# Altium project MOTHERBOARD.PrjPcb
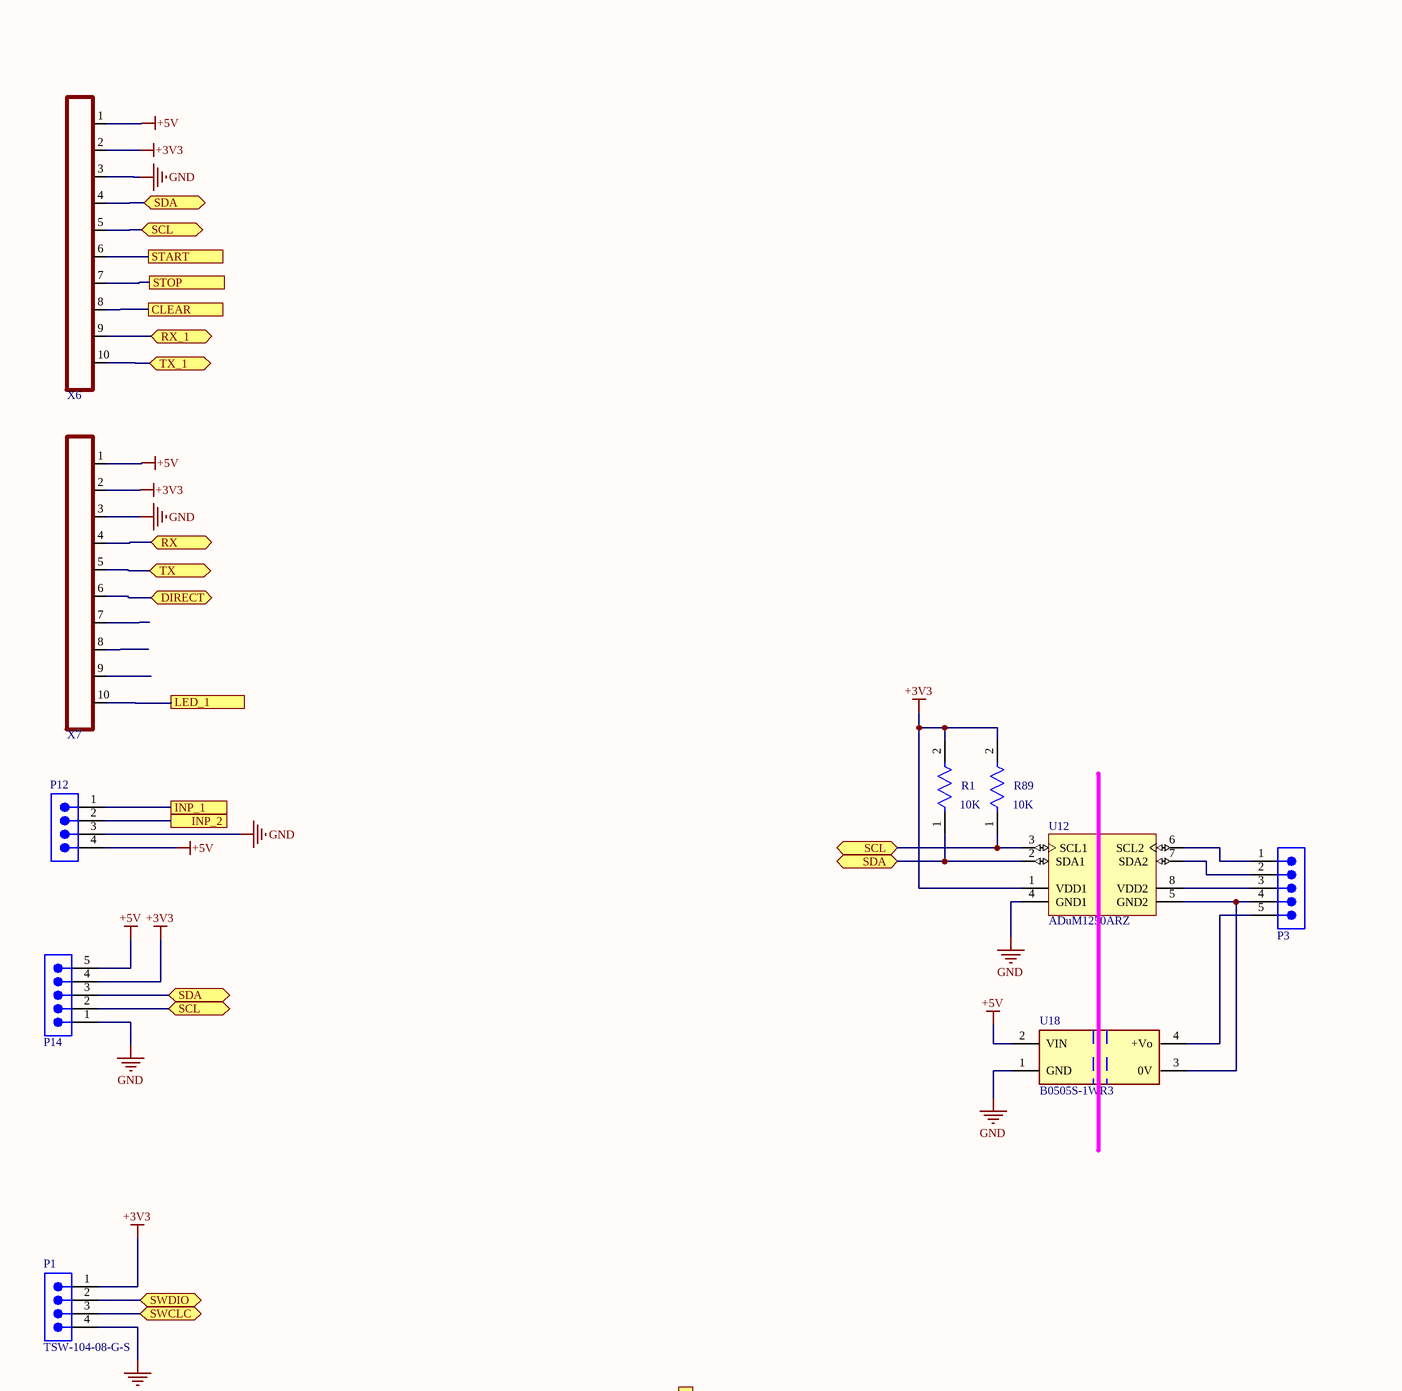
[diagram p0: MOTHERBOARD.SchDoc, top column 1 of 4]
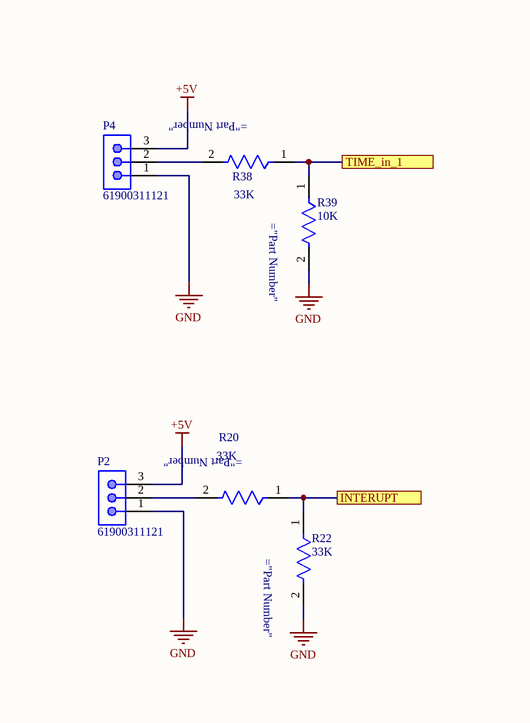
[diagram p1: MOTHERBOARD.SchDoc, top column 2 of 4]
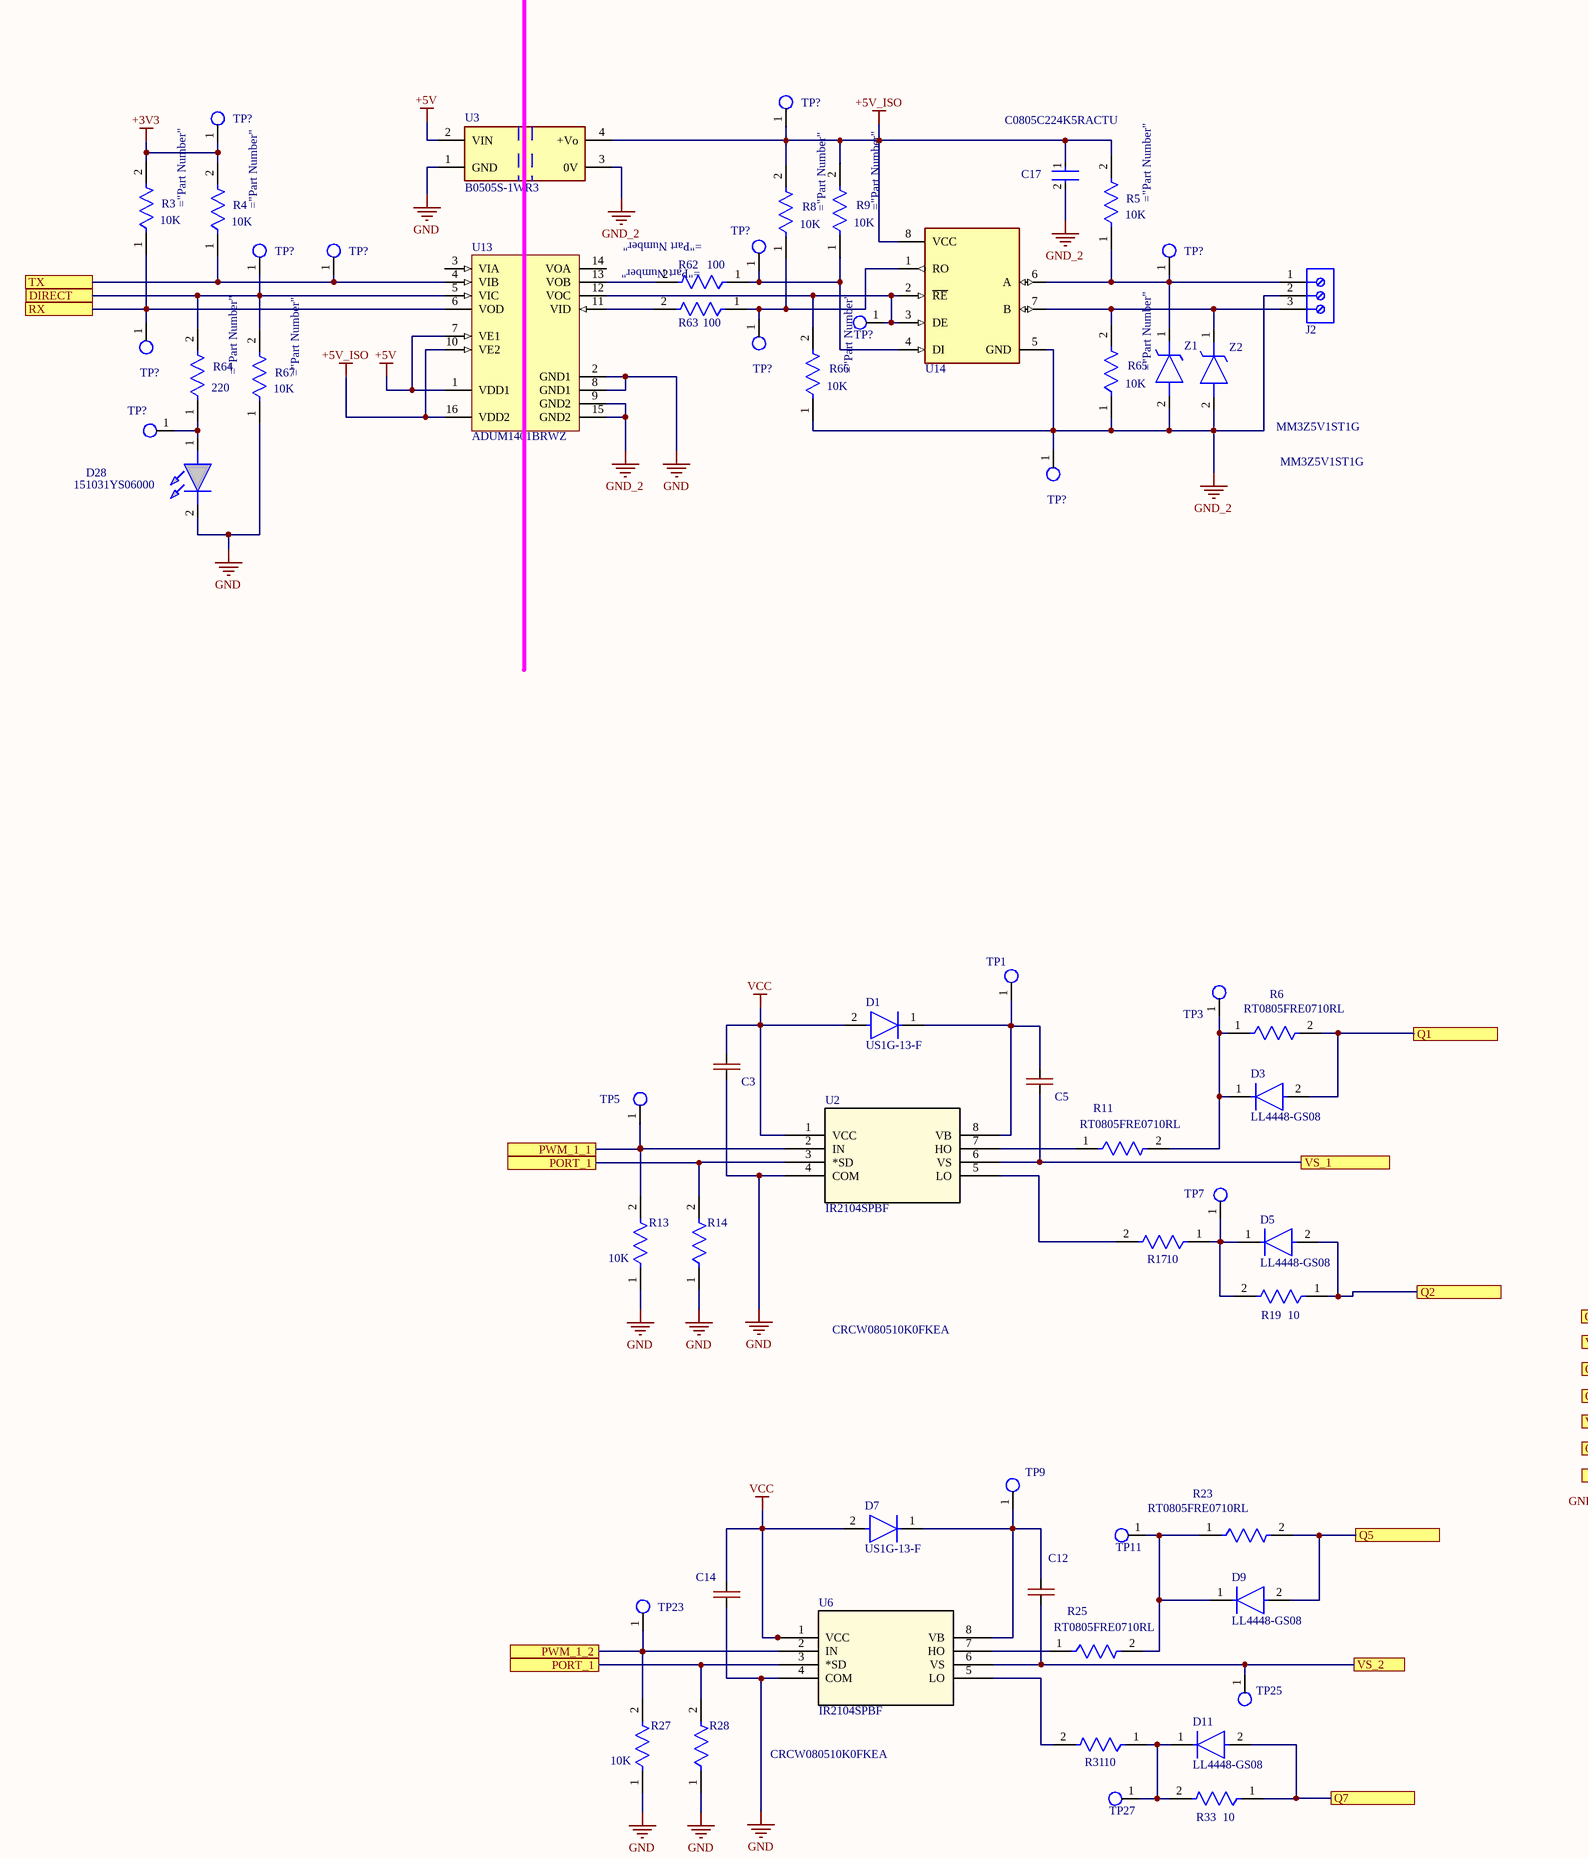
[diagram p2: MOTHERBOARD.SchDoc, top column 3 of 4]
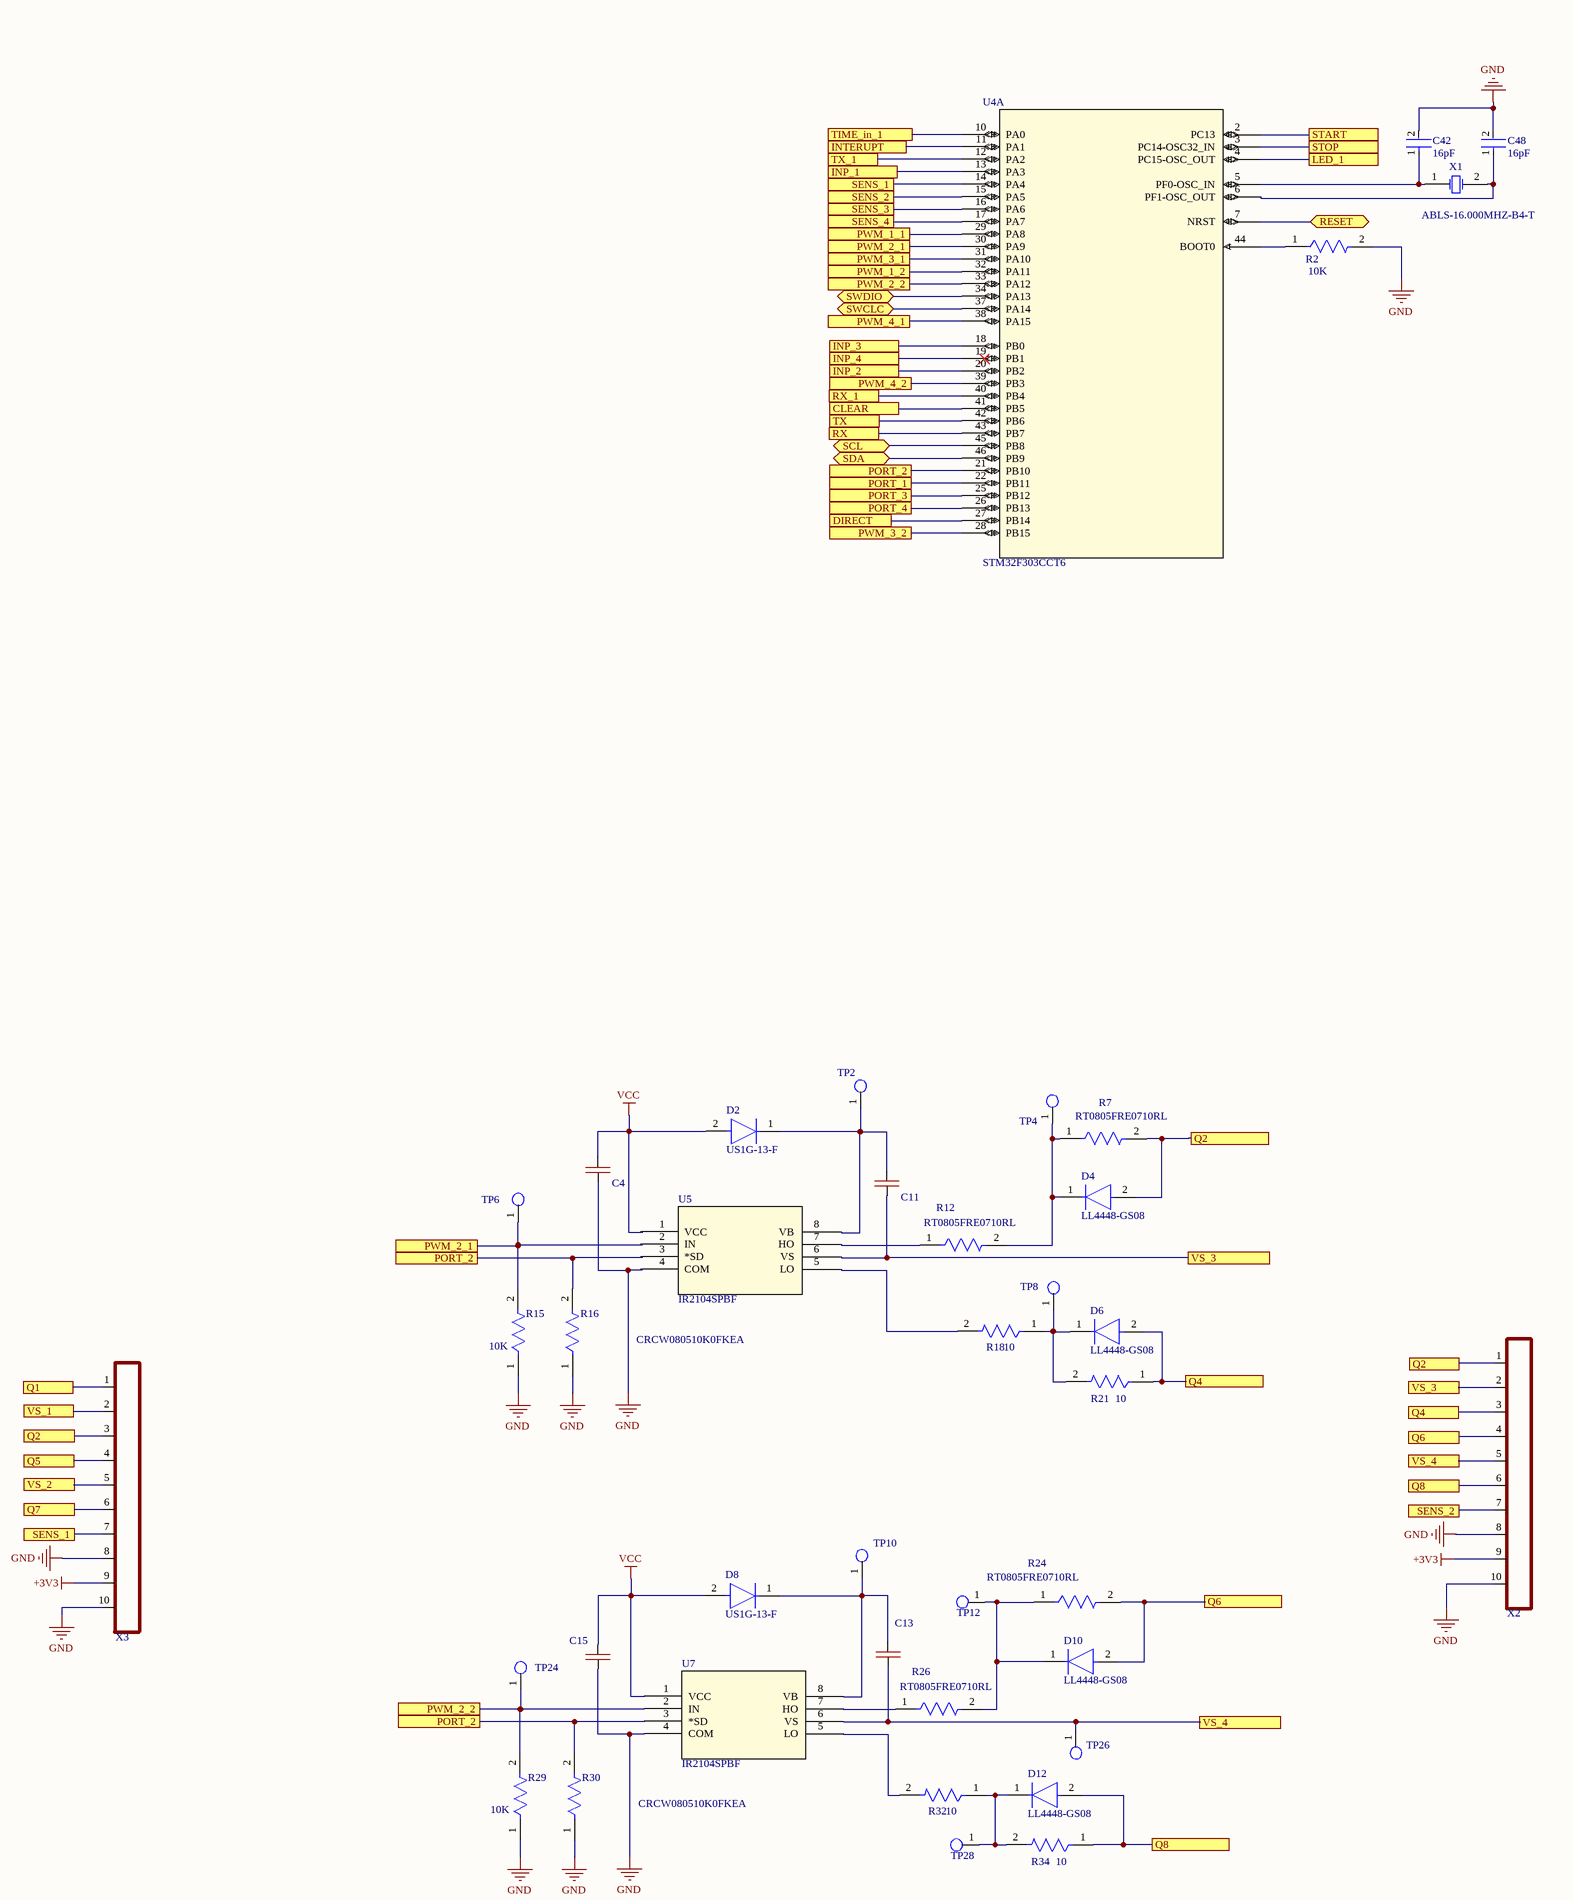
[diagram p3: MOTHERBOARD.SchDoc, top column 4 of 4]
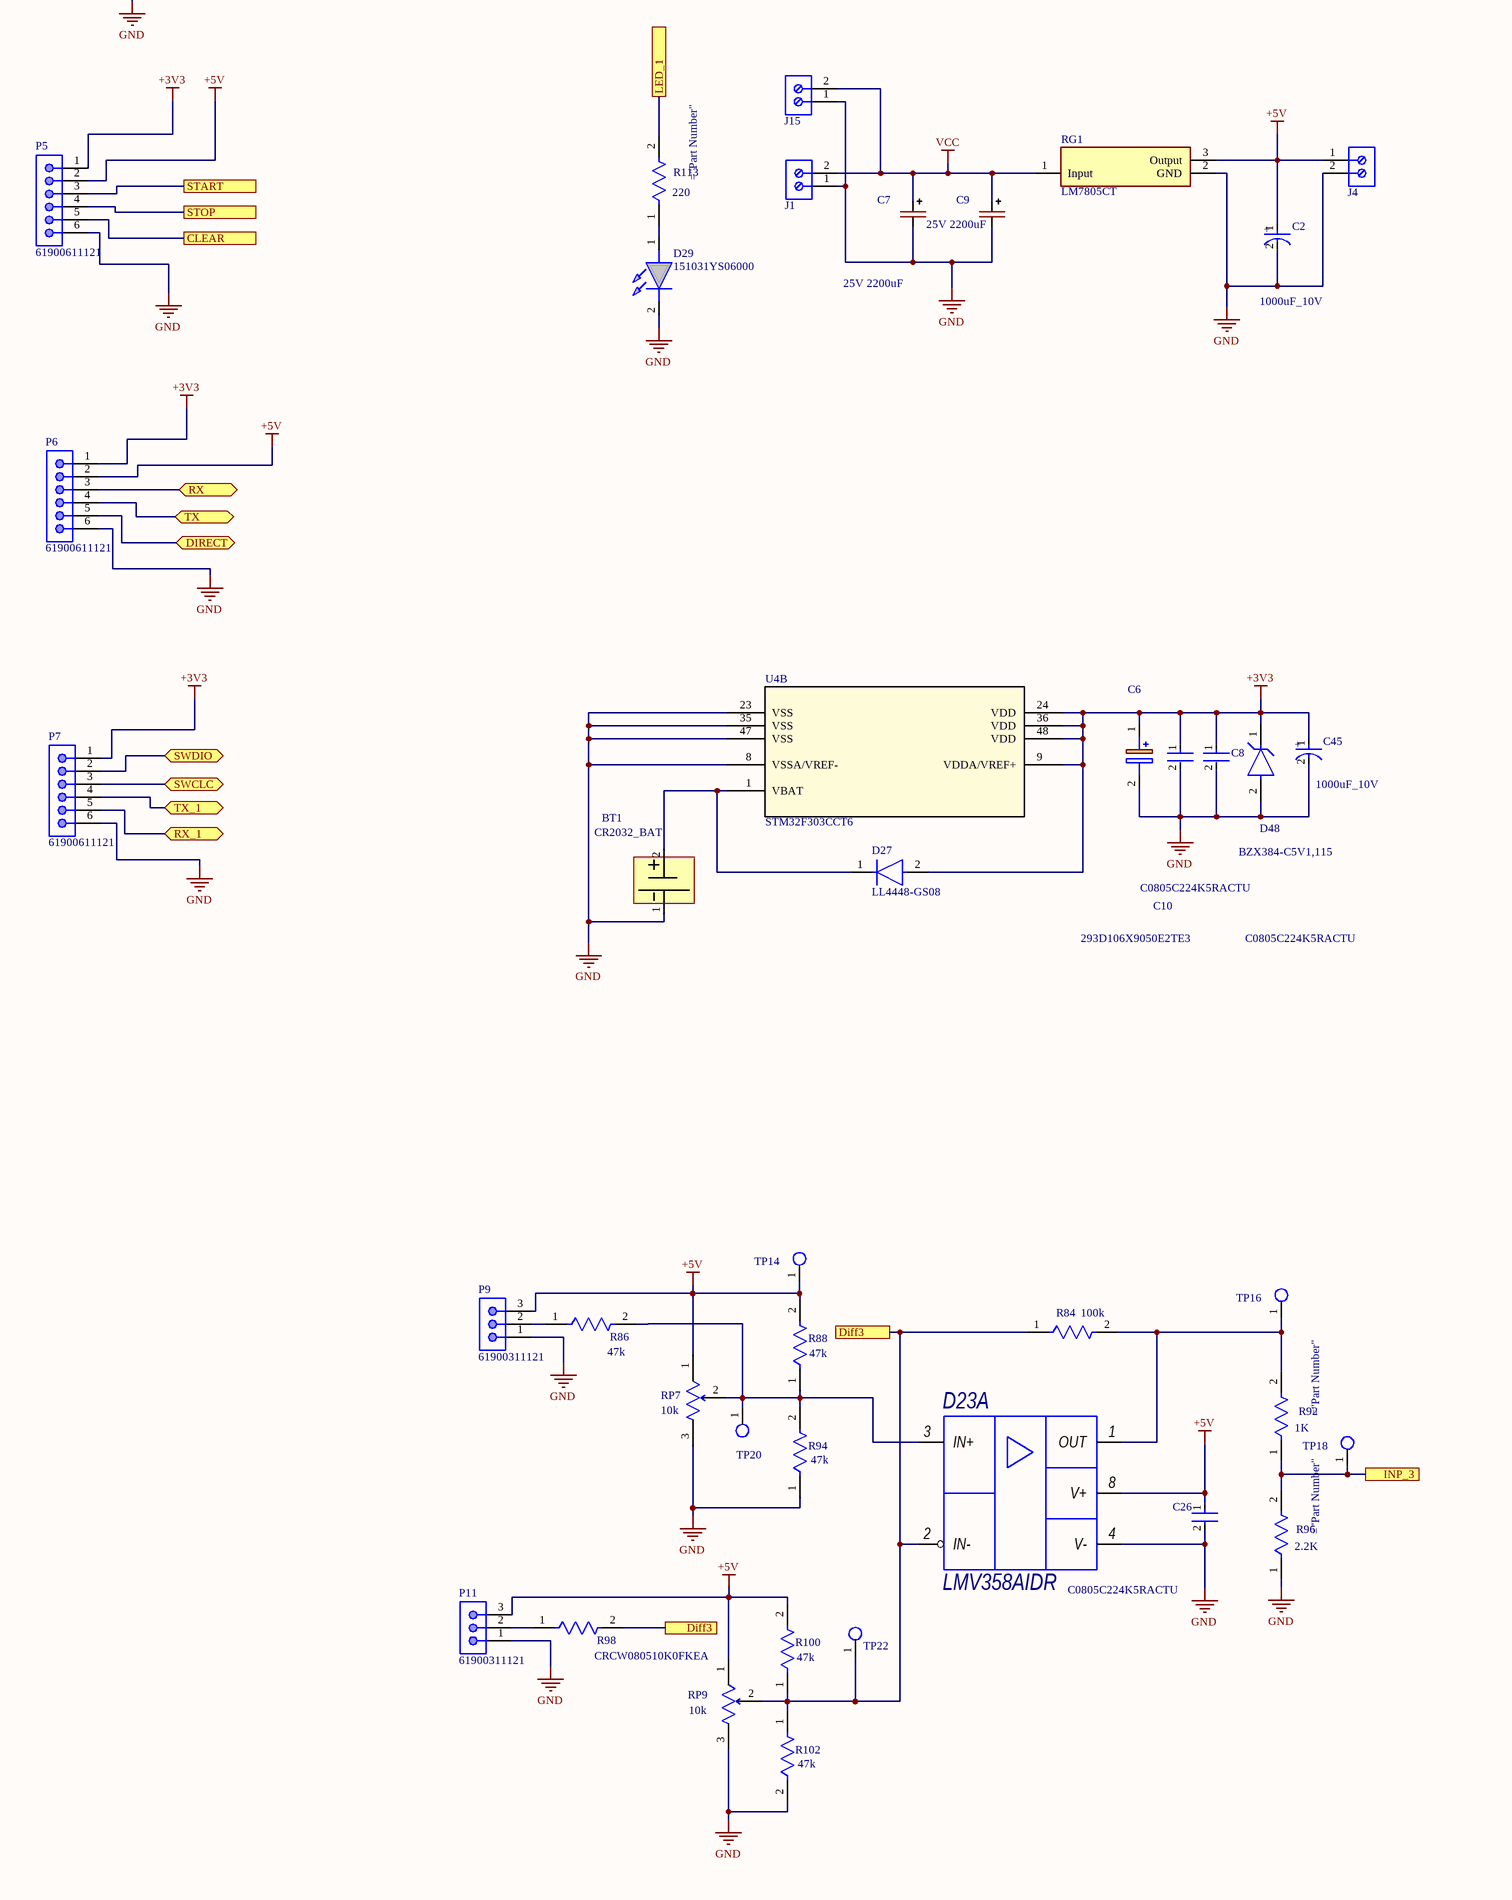
[diagram p4: MOTHERBOARD.SchDoc, bottom column 1 of 4]
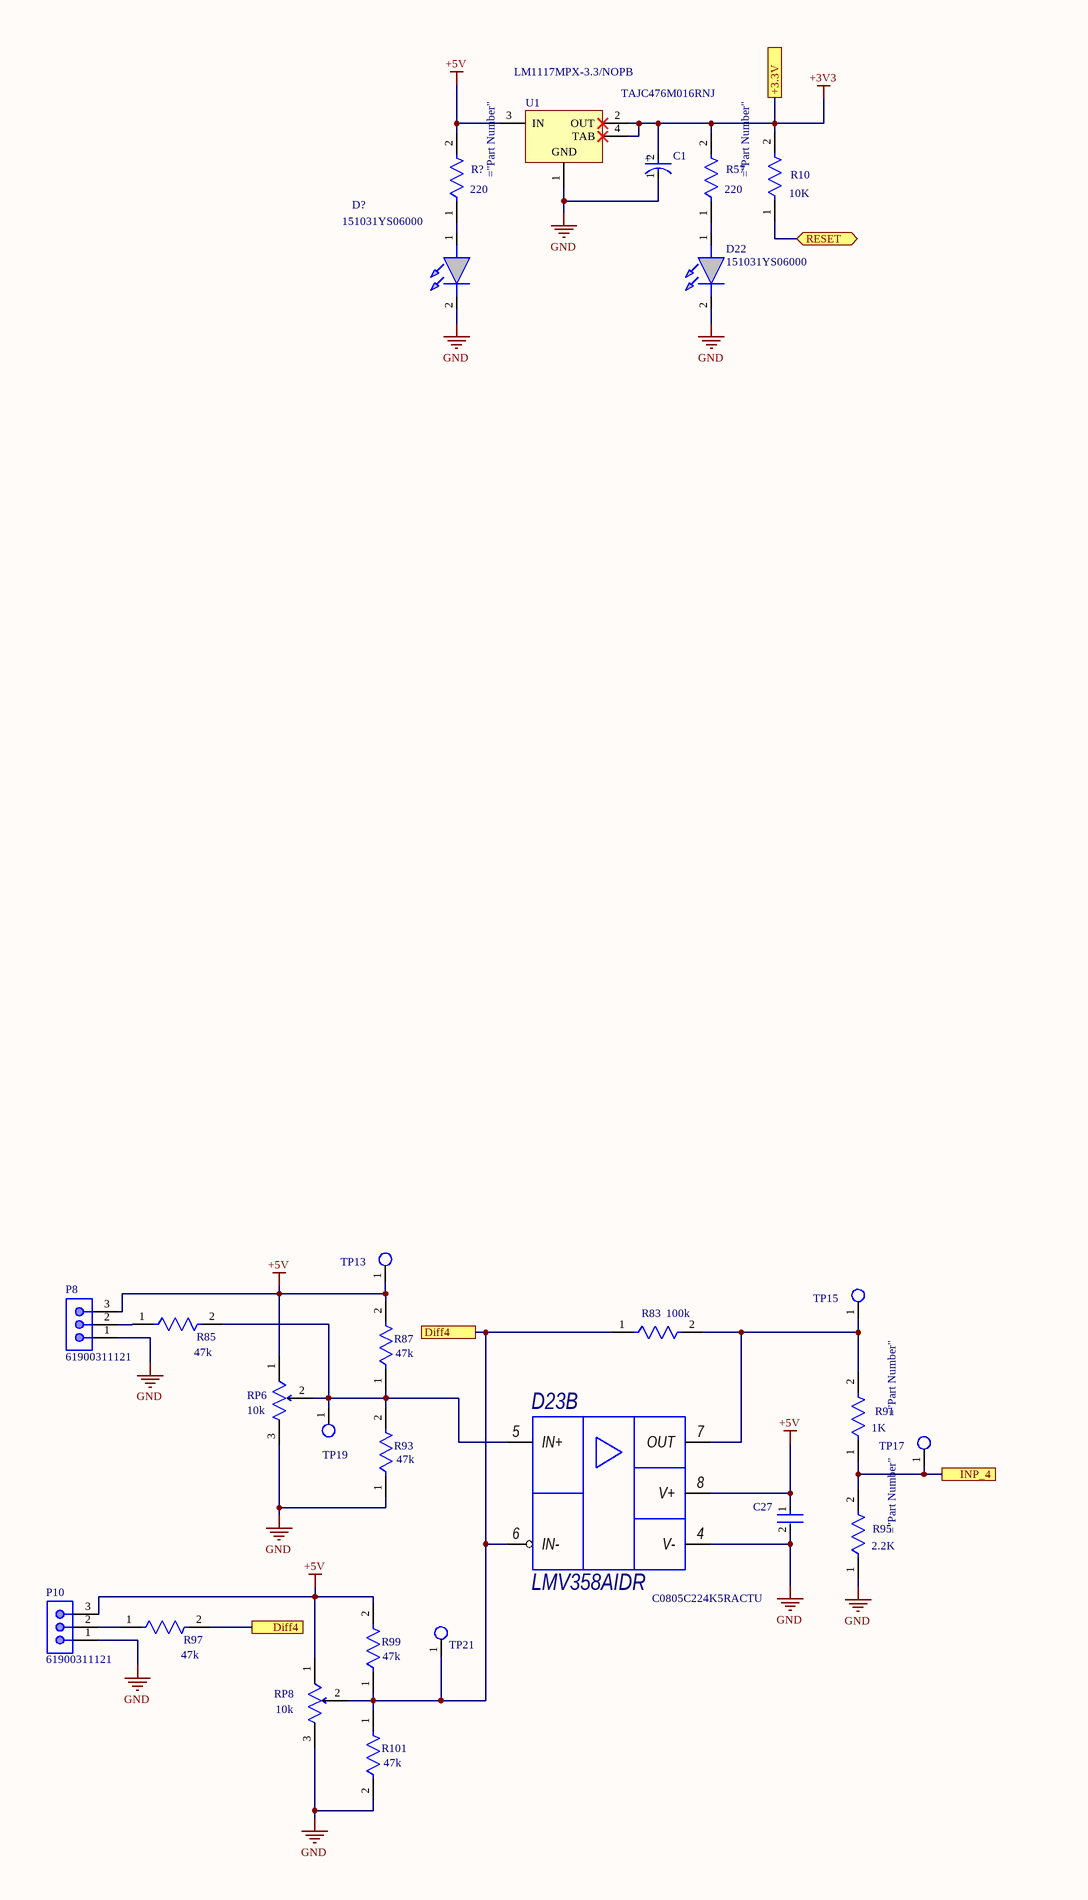
[diagram p5: MOTHERBOARD.SchDoc, bottom column 2 of 4]
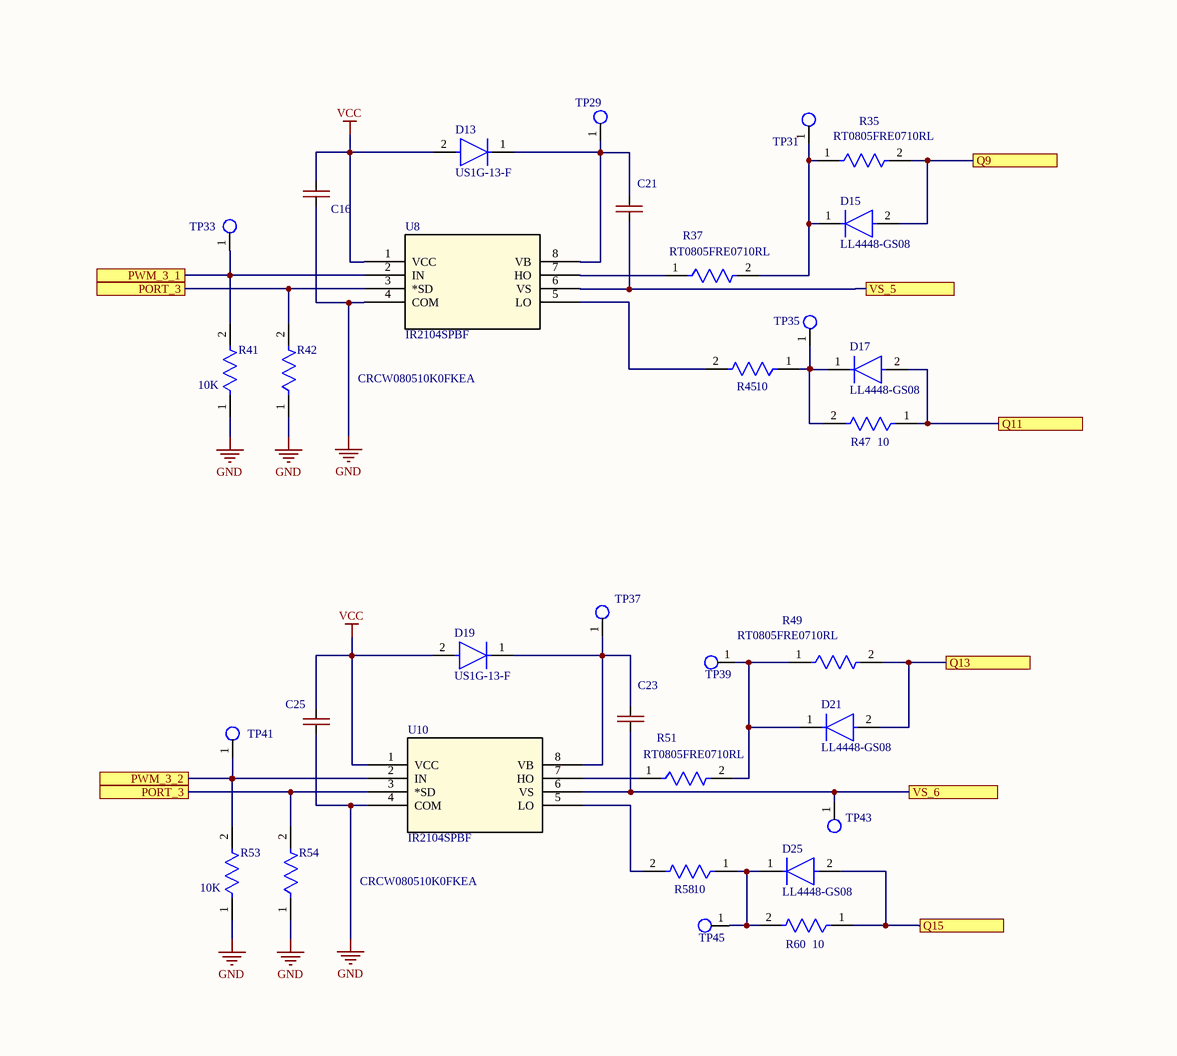
[diagram p6: MOTHERBOARD.SchDoc, bottom column 3 of 4]
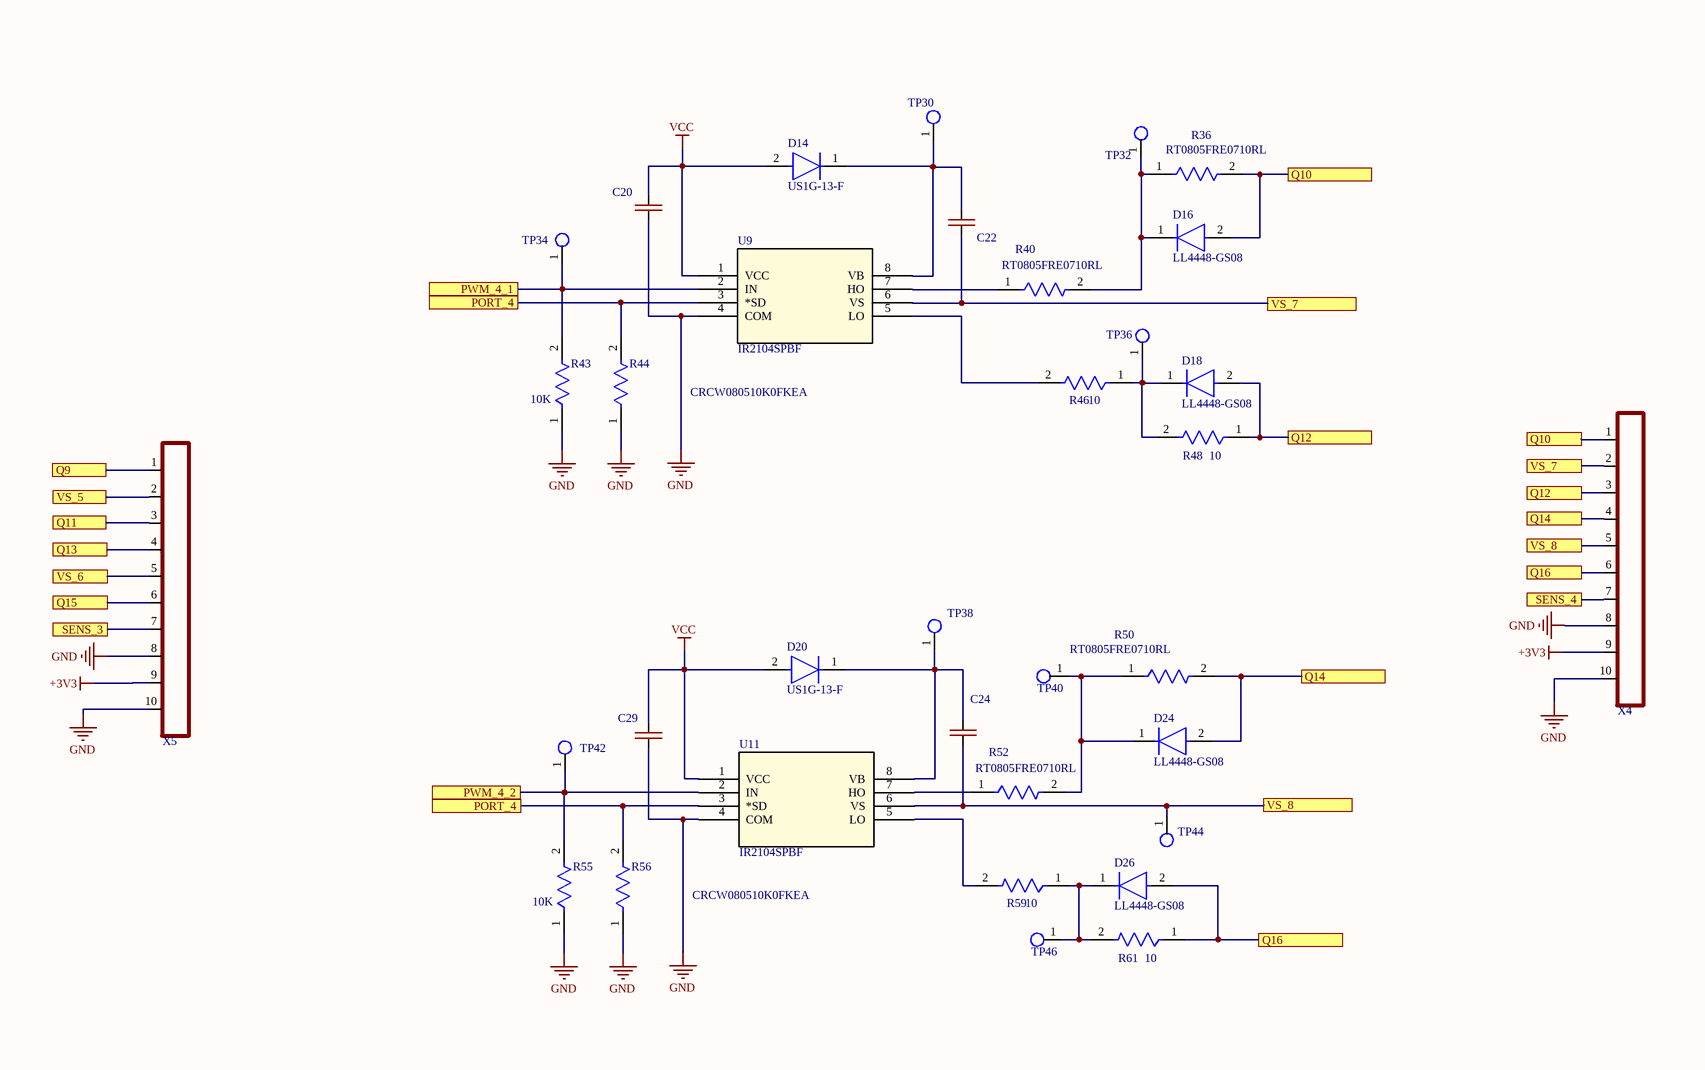
[diagram p7: MOTHERBOARD.SchDoc, bottom column 4 of 4]
1 sheet, 252 parts. Net scope: flat (ports and power ports of the same name join across sheets).
Board file: MOTHERBOARD.PcbDoc

## Sheet MOTHERBOARD.SchDoc
size 1249 x 800 mm; SheetNumber: 1; SheetTotal: 1

### Parts
(Parts that share a designator on the sheet are numbered #1, #2 ... from top to bottom, then left to right.)
BT1  CR2032_BAT  [CR2032_BAT]
C1  TAJC476M016RNJ  [FP-TAJC-MFG]
C2  1000uF_10V  [1000uF_10V_Size_F]
C3  CAP-NON-POLAR  [CAP-1206]  (value not drawn)
C4  CAP-NON-POLAR  [CAP-1206]  (value not drawn)
C5  CAP-NON-POLAR  [CAP-1206]  (value not drawn)
C6  293D106X9050E2TE3  [CAPPM7343X430N]
C7  25V 2200uF  [CAPPOL-12x25]
C8  C0805C224K5RACTU  [FP-C0805C-DN-MFG]
C9  25V 2200uF  [CAPPOL-12x25]
C10  C0805C224K5RACTU  [FP-C0805C-DN-MFG]
C11  CAP-NON-POLAR  [CAP-1206]  (value not drawn)
C12  CAP-NON-POLAR  [CAP-1206]  (value not drawn)
C13  CAP-NON-POLAR  [CAP-1206]  (value not drawn)
C14  CAP-NON-POLAR  [CAP-1206]  (value not drawn)
C15  CAP-NON-POLAR  [CAP-1206]  (value not drawn)
C16  CAP-NON-POLAR  [CAP-1206]  (value not drawn)
C17  C0805C224K5RACTU  [FP-C0805C-DN-MFG]
C20  CAP-NON-POLAR  [CAP-1206]  (value not drawn)
C21  CAP-NON-POLAR  [CAP-1206]  (value not drawn)
C22  CAP-NON-POLAR  [CAP-1206]  (value not drawn)
C23  CAP-NON-POLAR  [CAP-1206]  (value not drawn)
C24  CAP-NON-POLAR  [CAP-1206]  (value not drawn)
C25  CAP-NON-POLAR  [CAP-1206]  (value not drawn)
C26  C0805C224K5RACTU  [FP-C0805C-DN-MFG]
C27  C0805C224K5RACTU  [FP-C0805C-DN-MFG]
C29  CAP-NON-POLAR  [CAP-1206]  (value not drawn)
C42  16pF  [FP-C0805C-DN-MFG]
C45  1000uF_10V  [1000uF_10V_Size_F]
C48  16pF  [FP-C0805C-DN-MFG]
D1  US1G-13-F  [FP-SMA-MFG]
D2  US1G-13-F  [FP-SMA-MFG]
D3  LL4448-GS08  [FP-6_560-5005_01-4-MFG]
D4  LL4448-GS08  [FP-6_560-5005_01-4-MFG]
D5  LL4448-GS08  [FP-6_560-5005_01-4-MFG]
D6  LL4448-GS08  [FP-6_560-5005_01-4-MFG]
D7  US1G-13-F  [FP-SMA-MFG]
D8  US1G-13-F  [FP-SMA-MFG]
D9  LL4448-GS08  [FP-6_560-5005_01-4-MFG]
D10  LL4448-GS08  [FP-6_560-5005_01-4-MFG]
D11  LL4448-GS08  [FP-6_560-5005_01-4-MFG]
D12  LL4448-GS08  [FP-6_560-5005_01-4-MFG]
D13  US1G-13-F  [FP-SMA-MFG]
D14  US1G-13-F  [FP-SMA-MFG]
D15  LL4448-GS08  [FP-6_560-5005_01-4-MFG]
D16  LL4448-GS08  [FP-6_560-5005_01-4-MFG]
D17  LL4448-GS08  [FP-6_560-5005_01-4-MFG]
D18  LL4448-GS08  [FP-6_560-5005_01-4-MFG]
D19  US1G-13-F  [FP-SMA-MFG]
D20  US1G-13-F  [FP-SMA-MFG]
D21  LL4448-GS08  [FP-6_560-5005_01-4-MFG]
D22  151031YS06000  [LED_Yellow]
D23  LMV358AIDR  [8-SOIC]  (parts A,B of 2)
D24  LL4448-GS08  [FP-6_560-5005_01-4-MFG]
D25  LL4448-GS08  [FP-6_560-5005_01-4-MFG]
D26  LL4448-GS08  [FP-6_560-5005_01-4-MFG]
D27  LL4448-GS08  [FP-6_560-5005_01-4-MFG]
D28  151031YS06000  [LED_BLUE]
D29  151031YS06000  [Wurth_Electronics_0_MFG]
D48  BZX384-C5V1,115  [FP-SOD323-MFG]
D?  151031YS06000  [LED_Yellow]
J1  691101710002  [691101710002]  (value not drawn)
J2  691101710003  [691101710003]  (value not drawn)
J4  691101710002  [691101710002]  (value not drawn)
J15  691101710002  [691101710002]  (value not drawn)
P1  TSW-104-08-G-S  [SMTC-TSW-104-08-X-S]
P2  61900311121  [61900311121]
P3  61900511121  [61900511121]  (value not drawn)
P4  61900311121  [61900311121]
P5  61900611121  [61900611121]
P6  61900611121  [61900611121]
P7  61900611121  [61900611121]
P8  61900311121  [61900311121]
P9  61900311121  [61900311121]
P10  61900311121  [61900311121]
P11  61900311121  [61900311121]
P12  TSW-104-08-G-S  [SMTC-TSW-104-08-X-S]  (value not drawn)
P14  61300511121  [61300511121]  (value not drawn)
R1  10K  [Vishay_CRCW0805-e3_IPC_A]
R2  10K  [Vishay_CRCW0805-e3_IPC_A]
R3  10K  [Vishay_CRCW0805-e3_IPC_A]
R4  10K  [Vishay_CRCW0805-e3_IPC_A]
R5  10K  [Vishay_CRCW0805-e3_IPC_A]
R6  RT0805FRE0710RL  [FP-RT0805-IPC_C]
R7  RT0805FRE0710RL  [FP-RT0805-IPC_C]
R8  10K  [Yageo_RC0805_IPC_A]
R9  10K  [Yageo_RC0805_IPC_A]
R10  10K  [Vishay_CRCW0805-e3_IPC_A]
R11  RT0805FRE0710RL  [FP-RT0805-MFG]
R12  RT0805FRE0710RL  [FP-RT0805-MFG]
R13  10K  [FP-CRCW0805-e3-IPC_A]
R14  CRCW080510K0FKEA  [FP-CRCW0805-e3-IPC_A]
R15  10K  [FP-CRCW0805-e3-IPC_A]
R16  CRCW080510K0FKEA  [FP-CRCW0805-e3-IPC_A]
R17  10  [Vishay_CRCW0805-e3_IPC_A]
R18  10  [Vishay_CRCW0805-e3_IPC_A]
R19  10  [FP-CRCW0805-e3-IPC_B]
R20  33K  [Vishay_CRCW0805-e3_IPC_A]
R21  10  [FP-CRCW0805-e3-IPC_B]
R22  33K  [Vishay_CRCW0805-e3_IPC_A]
R23  RT0805FRE0710RL  [FP-RT0805-IPC_C]
R24  RT0805FRE0710RL  [FP-RT0805-IPC_C]
R25  RT0805FRE0710RL  [FP-RT0805-MFG]
R26  RT0805FRE0710RL  [FP-RT0805-MFG]
R27  10K  [FP-CRCW0805-e3-IPC_A]
R28  CRCW080510K0FKEA  [FP-CRCW0805-e3-IPC_A]
R29  10K  [FP-CRCW0805-e3-IPC_A]
R30  CRCW080510K0FKEA  [FP-CRCW0805-e3-IPC_A]
R31  10  [Vishay_CRCW0805-e3_IPC_A]
R32  10  [Vishay_CRCW0805-e3_IPC_A]
R33  10  [Vishay_CRCW0805-e3_IPC_A]
R34  10  [Vishay_CRCW0805-e3_IPC_A]
R35  RT0805FRE0710RL  [FP-RT0805-IPC_C]
R36  RT0805FRE0710RL  [FP-RT0805-IPC_C]
R37  RT0805FRE0710RL  [FP-RT0805-MFG]
R38  33K  [Vishay_CRCW0805-e3_IPC_A]
R39  10K  [Vishay_CRCW0805-e3_IPC_A]
R40  RT0805FRE0710RL  [FP-RT0805-MFG]
R41  10K  [FP-CRCW0805-e3-IPC_A]
R42  CRCW080510K0FKEA  [FP-CRCW0805-e3-IPC_A]
R43  10K  [FP-CRCW0805-e3-IPC_A]
R44  CRCW080510K0FKEA  [FP-CRCW0805-e3-IPC_A]
R45  10  [Vishay_CRCW0805-e3_IPC_A]
R46  10  [Vishay_CRCW0805-e3_IPC_A]
R47  10  [FP-CRCW0805-e3-IPC_B]
R48  10  [FP-CRCW0805-e3-IPC_B]
R49  RT0805FRE0710RL  [FP-RT0805-IPC_C]
R50  RT0805FRE0710RL  [FP-RT0805-IPC_C]
R51  RT0805FRE0710RL  [FP-RT0805-MFG]
R52  RT0805FRE0710RL  [FP-RT0805-MFG]
R53  10K  [FP-CRCW0805-e3-IPC_A]
R54  CRCW080510K0FKEA  [FP-CRCW0805-e3-IPC_A]
R55  10K  [FP-CRCW0805-e3-IPC_A]
R56  CRCW080510K0FKEA  [FP-CRCW0805-e3-IPC_A]
R57  220  [Yageo_RC0805_IPC_A]
R58  10  [Vishay_CRCW0805-e3_IPC_A]
R59  10  [Vishay_CRCW0805-e3_IPC_A]
R60  10  [Vishay_CRCW0805-e3_IPC_A]
R61  10  [Vishay_CRCW0805-e3_IPC_A]
R62  100  [Yageo_RC0805_IPC_A]
R63  100  [Yageo_RC0805_IPC_A]
R64  220  [Yageo_RC0805_IPC_A]
R65  10K  [Yageo_RC0805_IPC_A]
R66  10K  [Yageo_RC0805_IPC_A]
R67  10K  [Vishay_CRCW0805-e3_IPC_A]
R83  100k  [Vishay_CRCW0805-e3_IPC_A]
R84  100k  [Vishay_CRCW0805-e3_IPC_A]
R85  47k  [Vishay_CRCW0805-e3_IPC_A]
R86  47k  [Vishay_CRCW0805-e3_IPC_A]
R87  47k  [Vishay_CRCW0805-e3_IPC_A]
R88  47k  [FP-CRCW0805-e3-IPC_A]
R89  10K  [Vishay_CRCW0805-e3_IPC_A]
R91  1K  [Vishay_CRCW0805-e3_IPC_A]
R92  1K  [Vishay_CRCW0805-e3_IPC_A]
R93  47k  [Vishay_CRCW0805-e3_IPC_A]
R94  47k  [Vishay_CRCW0805-e3_IPC_A]
R95  2.2K  [Vishay_CRCW0805-e3_IPC_A]
R96  2.2K  [Vishay_CRCW0805-e3_IPC_A]
R97  47k  [Vishay_CRCW0805-e3_IPC_A]
R98  CRCW080510K0FKEA  [FP-CRCW0805-e3-IPC_A]
R99  47k  [Vishay_CRCW0805-e3_IPC_A]
R100  47k  [Vishay_CRCW0805-e3_IPC_A]
R101  47k  [Vishay_CRCW0805-e3_IPC_A]
R102  47k  [Vishay_CRCW0805-e3_IPC_A]
R113  220  [Yageo_RC0805_IPC_C]
R?  220  [Yageo_RC0805_IPC_A]
RG1  Part Number: LM7805CT  [TO-220(bend_rad)]  (hidden comment: Reg_Fairchild_LM7805CT_eec)
RP6  10k  [Bourns_3296W_MFG]
RP7  10k  [Bourns_3296W_MFG]
RP8  10k  [Bourns_3296W_MFG]
RP9  10k  [Bourns_3296W_MFG]
TP1  Test_Point_PCB  [Test_Point]  (value not drawn)
TP2  Test_Point_PCB  [Test_Point]  (value not drawn)
TP3  Test_Point_PCB  [Test_Point]  (value not drawn)
TP4  Test_Point_PCB  [Test_Point]  (value not drawn)
TP5  Test_Point_PCB  [Test_Point]  (value not drawn)
TP6  Test_Point_PCB  [Test_Point]  (value not drawn)
TP7  Test_Point_PCB  [Test_Point]  (value not drawn)
TP8  Test_Point_PCB  [Test_Point]  (value not drawn)
TP9  Test_Point_PCB  [Test_Point]  (value not drawn)
TP10  Test_Point_PCB  [Test_Point]  (value not drawn)
TP11  Test_Point_PCB  [Test_Point]  (value not drawn)
TP12  Test_Point_PCB  [Test_Point]  (value not drawn)
TP13  Test_Point_PCB  [Test_Point]  (value not drawn)
TP14  Test_Point_PCB  [Test_Point]  (value not drawn)
TP15  Test_Point_PCB  [Test_Point]  (value not drawn)
TP16  Test_Point_PCB  [Test_Point]  (value not drawn)
TP17  Test_Point_PCB  [Test_Point]  (value not drawn)
TP18  Test_Point_PCB  [Test_Point]  (value not drawn)
TP19  Test_Point_PCB  [Test_Point]  (value not drawn)
TP20  Test_Point_PCB  [Test_Point]  (value not drawn)
TP21  Test_Point_PCB  [Test_Point]  (value not drawn)
TP22  Test_Point_PCB  [Test_Point]  (value not drawn)
TP23  Test_Point_PCB  [Test_Point]  (value not drawn)
TP24  Test_Point_PCB  [Test_Point]  (value not drawn)
TP25  Test_Point_PCB  [Test_Point]  (value not drawn)
TP26  Test_Point_PCB  [Test_Point]  (value not drawn)
TP27  Test_Point_PCB  [Test_Point]  (value not drawn)
TP28  Test_Point_PCB  [Test_Point]  (value not drawn)
TP29  Test_Point_PCB  [Test_Point]  (value not drawn)
TP30  Test_Point_PCB  [Test_Point]  (value not drawn)
TP31  Test_Point_PCB  [Test_Point]  (value not drawn)
TP32  Test_Point_PCB  [Test_Point]  (value not drawn)
TP33  Test_Point_PCB  [Test_Point]  (value not drawn)
TP34  Test_Point_PCB  [Test_Point]  (value not drawn)
TP35  Test_Point_PCB  [Test_Point]  (value not drawn)
TP36  Test_Point_PCB  [Test_Point]  (value not drawn)
TP37  Test_Point_PCB  [Test_Point]  (value not drawn)
TP38  Test_Point_PCB  [Test_Point]  (value not drawn)
TP39  Test_Point_PCB  [Test_Point]  (value not drawn)
TP40  Test_Point_PCB  [Test_Point]  (value not drawn)
TP41  Test_Point_PCB  [Test_Point]  (value not drawn)
TP42  Test_Point_PCB  [Test_Point]  (value not drawn)
TP43  Test_Point_PCB  [Test_Point]  (value not drawn)
TP44  Test_Point_PCB  [Test_Point]  (value not drawn)
TP45  Test_Point_PCB  [Test_Point]  (value not drawn)
TP46  Test_Point_PCB  [Test_Point]  (value not drawn)
TP?#1  Test_Point_PCB  [Test_Point]  (value not drawn)
TP?#2  Test_Point_PCB  [Test_Point]  (value not drawn)
TP?#3  Test_Point_PCB  [Test_Point]  (value not drawn)
TP?#4  Test_Point_PCB  [Test_Point]  (value not drawn)
TP?#5  Test_Point_PCB  [Test_Point]  (value not drawn)
TP?#6  Test_Point_PCB  [Test_Point]  (value not drawn)
TP?#7  Test_Point_PCB  [Test_Point]  (value not drawn)
TP?#8  Test_Point_PCB  [Test_Point]  (value not drawn)
TP?#9  Test_Point_PCB  [Test_Point]  (value not drawn)
TP?#10  Test_Point_PCB  [Test_Point]  (value not drawn)
TP?#11  Test_Point_PCB  [Test_Point]  (value not drawn)
U1  LM1117MPX-3.3/NOPB  [DCY0004A_L]
U2  IR2104SPBF  [SOIC8_INF]
U3  B0505S-1WR3  [FP-B0505S-1WR3-MFG]
U4  STM32F303CCT6  [LQFP48-7x7mm]  (parts A,B of 2)
U5  IR2104SPBF  [SOIC8_INF]
U6  IR2104SPBF  [SOIC8_INF]
U7  IR2104SPBF  [SOIC8_INF]
U8  IR2104SPBF  [SOIC8_INF]
U9  IR2104SPBF  [SOIC8_INF]
U10  IR2104SPBF  [SOIC8_INF]
U11  IR2104SPBF  [SOIC8_INF]
U12  ADuM1250ARZ  [ADI-R-8_N]
U13  ADUM1401BRWZ  [ADI-RW-16_M]
U14  MAX485ECSA+  [SOIC127P600X175-8N]  (value not drawn)
U18  B0505S-1WR3  [FP-B0505S-1WR3-MFG]
X1  ABLS-16.000MHZ-B4-T  [ABRA-ABLS-14.7456MHZ-B2-T_V]
X2  BH-10  [BH-10]  (value not drawn)
X3  BH-10  [BH-10]  (value not drawn)
X4  BH-10  [BH-10]  (value not drawn)
X5  BH-10  [BH-10]  (value not drawn)
X6  BH-10  [BH-10]  (value not drawn)
X7  BH-10  [BH-10]  (value not drawn)
Z1  MM3Z5V1ST1G  [SOD2512X110N]
Z2  MM3Z5V1ST1G  [SOD2512X110N]

### Ports
+3.3V, CLEAR, Diff3, Diff4, DIRECT, DIRECT (bidir), INP_1, INP_2, INP_3, INP_4, INTERUPT, LED_1, PORT_1, PORT_2, PORT_3, PORT_4, PWM_1_1, PWM_1_2, PWM_2_1, PWM_2_2, PWM_3_1, PWM_3_2, PWM_4_1, PWM_4_2, Q1, Q2, Q4, Q5, Q6, Q7, Q8, Q9, Q10, Q11, Q12, Q13, Q14, Q15, Q16, RESET (bidir), RX, RX (bidir), RX_1, RX_1 (bidir), SCL (bidir), SDA (bidir), SENS_1, SENS_2, SENS_3, SENS_4, START, STOP, SWCLC (bidir), SWDIO (bidir), TIME_in_1, TX, TX (bidir), TX_1, TX_1 (bidir), VS_1, VS_2, VS_3, VS_4, VS_5, VS_6, VS_7, VS_8

### Nets
+3V3: C1.2(A) C6.1(+) C8.1 C10.1 C45.1(+) D27.2(A) D48.1(C) P1.1 P5.1 P6.1 P7.1 P14.4 R1.2 R3.2 R4.2 R10.2 R57.2 R89.2 TP?#2.1(G9) U1.2(OUT) U1.4(TAB) U4.9(VDDA/VREF+) U4.24(VDD) U4.36(VDD) U4.48(VDD) U12.1(VDD1) X2.9 X3.9 X4.9 X5.9 X6.2 X7.2 ; port +3.3V
+5V: C2.1(+) C26.1 C27.1 D23.8(V+) J4.1 P2.3 P4.3 P5.2 P6.2 P8.3 P9.3 P10.3 P11.3 P12.4 P14.5 R87.2 R88.2 R99.2 R100.2 R?.2 RG1.3(Output) RP6.1(CCW) RP7.1(CCW) RP8.1(CCW) RP9.1(CCW) TP13.1(G9) TP14.1(G9) U1.3(IN) U3.2(VIN) U13.1(VDD1) U13.7(VE1) U18.2(VIN) X6.1 X7.1
+5V_ISO: C17.1 R5.2 R8.2 R9.2 TP?#1.1(G9) U3.4(+Vo) U13.10(VE2) U13.16(VDD2) U14.8(VCC)
GND: BT1.1(-) C1.1(C) C2.2(-) C3.1 C4.1 C6.2(-) C7.2(-) C8.2 C9.2(-) C10.2 C14.1 C15.1 C16.1 C20.1 C25.1 C26.2 C27.2 C29.1 C42.2 C45.2(-) C48.2 D22.2(K) D23.4(V-) D28.2(K) D29.2(K) D48.2(A) D?.2(K) J1.1 J4.2 J15.1 P1.4 P2.1 P4.1 P5.6 P6.6 P7.6 P8.1 P9.1 P10.1 P11.1 P12.3 P14.1 R2.2 R13.1 R14.1 R15.1 R16.1 R22.2 R27.1 R28.1 R29.1 R30.1 R39.2 R41.1 R42.1 R43.1 R44.1 R53.1 R54.1 R55.1 R56.1 R67.1 R93.1 R94.1 R95.1 R96.1 R101.2 R102.2 RG1.2(GND) RP6.3(CW) RP7.3(CW) RP8.3(CW) RP9.3(CW) U1.1(GND) U2.4(COM) U3.1(GND) U4.8(VSSA/VREF-) U4.23(VSS) U4.35(VSS) U4.47(VSS) U5.4(COM) U6.4(COM) U7.4(COM) U8.4(COM) U9.4(COM) U10.4(COM) U11.4(COM) U12.4(GND1) U13.2(GND1) U13.8(GND1) U18.1(GND) X2.8 X2.10 X3.8 X3.10 X4.8 X4.10 X5.8 X5.10 X6.3 X7.3
GND_2: C17.2 J2.2 R65.1 R66.1 TP?#11.1(G9) U3.3(0V) U13.9(GND2) U13.15(GND2) U14.5(GND) Z1.2(A) Z2.2(A)
VCC: C3.2 C4.2 C7.1(+) C9.1(+) C14.2 C15.2 C16.2 C20.2 C25.2 C29.2 D1.2(A) D2.2(A) D7.2(A) D8.2(A) D13.2(A) D14.2(A) D19.2(A) D20.2(A) J1.2 J15.2 RG1.1(Input) U2.1(VCC) U5.1(VCC) U6.1(VCC) U7.1(VCC) U8.1(VCC) U9.1(VCC) U10.1(VCC) U11.1(VCC)
NetBT1_2: BT1.2(+) D27.1(C) U4.1(VBAT)
NetC5_1: C5.1 U2.6(VS) X3.2 ; port VS_1
NetC5_2: C5.2 D1.1(C) TP1.1(G9) U2.8(VB)
NetC11_1: C11.1 U5.6(VS) X2.2 ; port VS_3
NetC11_2: C11.2 D2.1(C) TP2.1(G9) U5.8(VB)
NetC12_1: C12.1 TP25.1(G9) U6.6(VS) X3.5 ; port VS_2
NetC12_2: C12.2 D7.1(C) TP9.1(G9) U6.8(VB)
NetC13_1: C13.1 TP26.1(G9) U7.6(VS) X2.5 ; port VS_4
NetC13_2: C13.2 D8.1(C) TP10.1(G9) U7.8(VB)
NetC21_1: C21.1 U8.6(VS) X5.2 ; port VS_5
NetC21_2: C21.2 D13.1(C) TP29.1(G9) U8.8(VB)
NetC22_1: C22.1 U9.6(VS) X4.2 ; port VS_7
NetC22_2: C22.2 D14.1(C) TP30.1(G9) U9.8(VB)
NetC23_1: C23.1 TP43.1(G9) U10.6(VS) X5.5 ; port VS_6
NetC23_2: C23.2 D19.1(C) TP37.1(G9) U10.8(VB)
NetC24_1: C24.1 TP44.1(G9) U11.6(VS) X4.5 ; port VS_8
NetC24_2: C24.2 D20.1(C) TP38.1(G9) U11.8(VB)
NetC42_1: C42.1 U4.5(PF0-OSC_IN) X1.1(X1)
NetC48_1: C48.1 U4.6(PF1-OSC_OUT) X1.2(X2)
NetD3_1: D3.1(C) R6.1 R11.2 TP3.1(G9)
NetD3_2: D3.2(A) R6.2 X3.1 ; port Q1
NetD4_1: D4.1(C) R7.1 R12.2 TP4.1(G9)
NetD4_2: D4.2(A) D5.2(A) R7.2 R19.1 X2.1 X3.3 ; port Q2
NetD5_1: D5.1(C) R17.1 R19.2 TP7.1(G9)
NetD6_1: D6.1(C) R18.1 R21.2 TP8.1(G9)
NetD6_2: D6.2(A) R21.1 X2.3 ; port Q4
NetD9_1: D9.1(C) R23.1 R25.2 TP11.1(G9)
NetD9_2: D9.2(A) R23.2 X3.4 ; port Q5
NetD10_1: D10.1(C) R24.1 R26.2 TP12.1(G9)
NetD10_2: D10.2(A) R24.2 X2.4 ; port Q6
NetD11_1: D11.1(C) R31.1 R33.2 TP27.1(G9)
NetD11_2: D11.2(A) R33.1 X3.6 ; port Q7
NetD12_1: D12.1(C) R32.1 R34.2 TP28.1(G9)
NetD12_2: D12.2(A) R34.1 X2.6 ; port Q8
NetD15_1: D15.1(C) R35.1 R37.2 TP31.1(G9)
NetD15_2: D15.2(A) R35.2 X5.1 ; port Q9
NetD16_1: D16.1(C) R36.1 R40.2 TP32.1(G9)
NetD16_2: D16.2(A) R36.2 X4.1 ; port Q10
NetD17_1: D17.1(C) R45.1 R47.2 TP35.1(G9)
NetD17_2: D17.2(A) R47.1 X5.3 ; port Q11
NetD18_1: D18.1(C) R46.1 R48.2 TP36.1(G9)
NetD18_2: D18.2(A) R48.1 X4.3 ; port Q12
NetD21_1: D21.1(C) R49.1 R51.2 TP39.1(G9)
NetD21_2: D21.2(A) R49.2 X5.4 ; port Q13
NetD22_1: D22.1(A) R57.1
NetD23_1: D23.1(OUT) R84.2 R92.2 TP16.1(G9)
NetD23_2: D23.2(IN-) R84.1 R98.2 R100.1 R102.1 RP9.2(WIPER) TP22.1(G9) ; port Diff3
NetD23_3: D23.3(IN+) R86.2 R88.1 R94.2 RP7.2(WIPER) TP20.1(G9)
NetD23_5: D23.5(IN+) R85.2 R87.1 R93.2 RP6.2(WIPER) TP19.1(G9)
NetD23_6: D23.6(IN-) R83.1 R97.2 R99.1 R101.1 RP8.2(WIPER) TP21.1(G9) ; port Diff4
NetD23_7: D23.7(OUT) R83.2 R91.2 TP15.1(G9)
NetD24_1: D24.1(C) R50.1 R52.2 TP40.1(G9)
NetD24_2: D24.2(A) R50.2 X4.4 ; port Q14
NetD25_1: D25.1(C) R58.1 R60.2 TP45.1(G9)
NetD25_2: D25.2(A) R60.1 X5.6 ; port Q15
NetD26_1: D26.1(C) R59.1 R61.2 TP46.1(G9)
NetD26_2: D26.2(A) R61.1 X4.6 ; port Q16
NetD28_1: D28.1(A) R64.1 TP?#10.1(G9)
NetD29_1: D29.1(A) R113.1
NetD?_1: D?.1(A) R?.1
NetJ2_1: J2.1 R5.1 TP?#6.1(G9) U14.6(A) Z1.1(K)
NetJ2_3: J2.3 R65.2 U14.7(B) Z2.1(K)
NetP1_2: P1.2 P7.2 U4.34(PA13) ; port SWDIO
NetP1_3: P1.3 P7.3 U4.37(PA14) ; port SWCLC
NetP2_2: P2.2 R20.2
NetP3_1: P3.1 U12.6(SCL2)
NetP3_2: P3.2 U12.7(SDA2)
NetP3_3: P3.3 U12.8(VDD2)
NetP3_4: P3.4 U12.5(GND2) U18.3(0V)
NetP3_5: P3.5 U18.4(+Vo)
NetP4_2: P4.2 R38.2
NetP5_3: P5.3 U4.2(PC13) X6.6 ; port START
NetP5_4: P5.4 U4.3(PC14-OSC32_IN) X6.7 ; port STOP
NetP5_5: P5.5 U4.41(PB5) X6.8 ; port CLEAR
NetP6_3: P6.3 R3.1 TP?#9.1(G9) U4.43(PB7) U13.6(VOD) X7.4 ; port RX
NetP6_4: P6.4 R4.1 TP?#5.1(G9) U4.42(PB6) U13.4(VIB) X7.5 ; port TX
NetP6_5: P6.5 R64.2 R67.2 TP?#4.1(G9) U4.27(PB14) U13.5(VIC) X7.6 ; port DIRECT
NetP7_4: P7.4 U4.12(PA2) X6.10 ; port TX_1
NetP7_5: P7.5 U4.40(PB4) X6.9 ; port RX_1
NetP8_2: P8.2 R85.1
NetP9_2: P9.2 R86.1
NetP10_2: P10.2 R97.1
NetP11_2: P11.2 R98.1
NetP12_1: P12.1 U4.13(PA3) ; port INP_1
NetP12_2: P12.2 U4.20(PB2) ; port INP_2
NetP14_2: P14.2 R89.1 U4.45(PB8) U12.3(SCL1) X6.5 ; port SCL
NetP14_3: P14.3 R1.1 U4.46(PB9) U12.2(SDA1) X6.4 ; port SDA
NetR2_1: R2.1 U4.44(BOOT0)
NetR8_1: R8.1 R63.1 TP?#7.1(G9) U14.1(RO)
NetR9_1: R9.1 R62.1 TP?#3.1(G9) U14.4(DI)
NetR10_1: R10.1 U4.7(NRST) ; port RESET
NetR11_1: R11.1 U2.7(HO)
NetR12_1: R12.1 U5.7(HO)
NetR13_2: R13.2 TP5.1(G9) U2.2(IN) U4.29(PA8) ; port PWM_1_1
NetR14_2: R14.2 R28.2 U2.3(*SD) U4.22(PB11) U6.3(*SD) ; port PORT_1
NetR15_2: R15.2 TP6.1(G9) U4.30(PA9) U5.2(IN) ; port PWM_2_1
NetR16_2: R16.2 R30.2 U4.21(PB10) U5.3(*SD) U7.3(*SD) ; port PORT_2
NetR17_2: R17.2 U2.5(LO)
NetR18_2: R18.2 U5.5(LO)
NetR20_1: R20.1 R22.1 U4.11(PA1) ; port INTERUPT
NetR25_1: R25.1 U6.7(HO)
NetR26_1: R26.1 U7.7(HO)
NetR27_2: R27.2 TP23.1(G9) U4.32(PA11) U6.2(IN) ; port PWM_1_2
NetR29_2: R29.2 TP24.1(G9) U4.33(PA12) U7.2(IN) ; port PWM_2_2
NetR31_2: R31.2 U6.5(LO)
NetR32_2: R32.2 U7.5(LO)
NetR37_1: R37.1 U8.7(HO)
NetR38_1: R38.1 R39.1 U4.10(PA0) ; port TIME_in_1
NetR40_1: R40.1 U9.7(HO)
NetR41_2: R41.2 TP33.1(G9) U4.31(PA10) U8.2(IN) ; port PWM_3_1
NetR42_2: R42.2 R54.2 U4.25(PB12) U8.3(*SD) U10.3(*SD) ; port PORT_3
NetR43_2: R43.2 TP34.1(G9) U4.38(PA15) U9.2(IN) ; port PWM_4_1
NetR44_2: R44.2 R56.2 U4.26(PB13) U9.3(*SD) U11.3(*SD) ; port PORT_4
NetR45_2: R45.2 U8.5(LO)
NetR46_2: R46.2 U9.5(LO)
NetR51_1: R51.1 U10.7(HO)
NetR52_1: R52.1 U11.7(HO)
NetR53_2: R53.2 TP41.1(G9) U4.28(PB15) U10.2(IN) ; port PWM_3_2
NetR55_2: R55.2 TP42.1(G9) U4.39(PB3) U11.2(IN) ; port PWM_4_2
NetR58_2: R58.2 U10.5(LO)
NetR59_2: R59.2 U11.5(LO)
NetR62_2: R62.2 U13.13(VOB)
NetR63_2: R63.2 U13.11(VID)
NetR66_2: R66.2 TP?#8.1(G9) U13.12(VOC) U14.2(~{RE}) U14.3(DE)
NetR91_1: R91.1 R95.2 TP17.1(G9) U4.19(PB1) ; port INP_4
NetR92_1: R92.1 R96.2 TP18.1(G9) U4.18(PB0) ; port INP_3
NetR113_2: R113.2 U4.4(PC15-OSC_OUT) X7.10 ; port LED_1
NetU4_14: U4.14(PA4) X3.7 ; port SENS_1
NetU4_15: U4.15(PA5) X2.7 ; port SENS_2
NetU4_16: U4.16(PA6) X5.7 ; port SENS_3
NetU4_17: U4.17(PA7) X4.7 ; port SENS_4

Not connected (* = marked no-connect by the designer): U13 3(VIA) 14(VOA); X7 7 8 9

### Notes on the sheet
- (in symbol CMP-04424-000193-1) +

### Library data of the parts
C1 = CMP-04424-000193-1: 47uF 16V  ±20% 500mΩ 2312  SMD Tantalum Capacitor; Polarity: Polar; ESR (Equivalent Series Resistance): 500mR; Dissipation Factor: 6%; Leakage Current: 7.5uA; RoHS Compliant: Yes; Case/Package: 6032-28; Construction: Flat; Case Code (Imperial): 2312; Package Quantity: 1; Voltage Rating: 16V; Length: 6mm; Height - Seated (Max): 0.11inch; Voltage Rating (DC): 16V; Series: TAJ; Features: General Purpose; Radiation Hardening: No; Case Code (Metric): 6032; Tolerance: 20%; Max Operating Temperature: 125°C; Depth: 3.2mm; REACH SVHC: No SVHC; Capacitance: 47uF; Width: 3.2mm; Height: 2.8mm; Lead Free: Lead Free; Packaging: Tape and Reel; Number of Pins: 2; Min Operating Temperature: -55°C; Mount: Surface Mount; Termination: SMD/SMT
C2 C45 = 1000uF_10V_Size_F
C6 = 293D106X9050E2TE3: Capacitor Polarised; Manufacturer_Name: Vishay; Datasheet Link: http://www.vishay.com/doc?40002; Height: 4.3mm; Manufacturer_Part_Number: 293D106X9050E2TE3; Mouser Part Number: 74-293D106X9050E2TE3; Mouser Price/Stock: https://www.mouser.com/Search/Refine.aspx?Keyword=74-293D106X9050E2TE3; Arrow Part Number: 293D106X9050E2TE3; Arrow Price/Stock: https://www.arrow.com/en/products/293d106x9050e2te3/vishay
C7 C9 = CAP-POLAR
C8 C10 C17 C26 C27 = CMP-1036-04552-2: CAP CER 0.22UF 50V X7R 0805; Manufacturer: KEMET; Value: 0.22 μF; Temperature Coefficient: 30ppm/°C; Material: Ceramic; Tolerance: 0.1; ComponentLink2URL: https://content.kemet.com/datasheets/KEM_C1003_C0G_SMD.pdf; Temperature Characteristic: X7R; Device Class L3: Ceramic Capacitors; Lead Free: Yes; Temperature: -55°C to +125°C; RoHS: TRUE; Capacitance: 0.22 μF; Automotive: No; Octopart: https://octopart.com/c0805c224k5ractu-kemet-144670; Manufacturer Part Number: C0805C224K5RACTU; Temperature Range Low: -55°C; Height: 0.88mm; Device Class L1: Passive Components; Digikey Description: CAP CER 0.22UF 50V X7R 0805; ComponentLink2Description: Datasheet; Mouser Description: CAP CER 0.22UF 50V X7R 0805; Category: Cap; Ipc Land Pattern Name: CAPC200125X78; Temperature Range High: +125°C; Package: C0805C-DN; Device Class L2: Capacitors; Voltage Rating: 50 V
C42 C48 = CMP-1036-04552-2: CAP CER 16pF 50V X7R 0805; Manufacturer: KEMET; Manufacturer Part Number: C0805C224K5RACTU; Value: 0.22 μF; Temperature Coefficient: 30ppm/°C; Material: Ceramic; Tolerance: 0.1; ComponentLink2URL: https://content.kemet.com/datasheets/KEM_C1003_C0G_SMD.pdf; Temperature Characteristic: X7R; Device Class L3: Ceramic Capacitors; Lead Free: Yes; Temperature: -55°C to +125°C; RoHS: TRUE; Capacitance: 0.22 μF; Automotive: No; Octopart: https://octopart.com/c0805c224k5ractu-kemet-144670; Temperature Range Low: -55°C; Height: 0.88mm; Device Class L1: Passive Components; Digikey Description: CAP CER 0.22UF 50V X7R 0805; ComponentLink2Description: Datasheet; Mouser Description: CAP CER 0.22UF 50V X7R 0805; Category: Cap; Ipc Land Pattern Name: CAPC200125X78; Temperature Range High: +125°C; Package: C0805C-DN; Device Class L2: Capacitors; Voltage Rating: 50 V
D1 D2 D7 D8 D13 D14 D19 D20 = CMP-12791-000009-1: DIODE GEN PURP 400V 1A SMA; Manufacturer: Diodes Inc.; Max Surge Forward Current: 30A; Peak Reverse Current: 5uA; Standoff Height: 0.05mm; Value: 20pF; Max Junction Temp: +150°C; Digikey Description: DIODE GEN PURP 400V 1A SMA; ComponentLink2URL: https://www.diodes.com/assets/Datasheets/ds16008.pdf; Device Class L1: Discrete Semiconductors; Mouser Description: Rectifiers 400V 1A; Manufacturer Part Number: US1G-13-F; Package: SMA; Height: 2.4mm; Automotive: No; Temperature Range High: +150°C; RoHS: TRUE; Lead Free: Yes; Temperature: -65°C to +150°C; Category: Diode; Octopart: https://octopart.com/us1g-13-f-diodes+inc.-334651; Temperature Range Low: -65°C; Forward Current: 1A; Footprint Url: https://www.diodes.com/assets/Package-Files/SMA.pdf; ComponentLink2Description: Datasheet; Reverse Voltage: 400V; Capacitance: 20pF; Device Class L3: Rectifier Diodes; Max Repetitive Reverse Voltage: 400V; Device Class L2: Diodes
D3-D6 D9-D12 D15-D18 D21 D24-D27 = CMP-249167-000001-1: DIODE GEN PURP 75V 150MA SOD80; Manufacturer: Vishay Small Signal; Max Junction Temp: +175°C; Automotive Grade: Grade 0; Capacitance: 4pF; Peak Reverse Current: 5uA; Forward Current: 300mA; Max Repetitive Reverse Voltage: 100V; Max Surge Forward Current: 2A; Value: 4pF; ComponentLink2Description: Datasheet; Height: 1.6mm; ComponentLink2URL: http://www.vishay.com/docs/85557/ll4148.pdf; Category: Diode; Lead Free: Yes; Device Class L3: Rectifier Diodes; Reverse Voltage: 75V; Mouser Description: Diodes - General Purpose, Power, Switching 100 Volt 100mA; RoHS: TRUE; Temperature: to +175°C; Automotive: Yes; Octopart: https://octopart.com/ll4448-gs08-vishay+small+signal-40886; Digikey Description: DIODE GEN PURP 75V 150MA SOD80; Manufacturer Part Number: LL4448-GS08; Temperature Range High: +175°C; Device Class L1: Discrete Semiconductors; Device Class L2: Diodes; Package: 6.560-5005.01-4
D22 D28 D29 D? = 151031YS06000: WURTH ELEKTRONIK - 151031YS06000 - LED, Yellow, Through Hole, T-1 (3mm), 30 mA, 2 V, 590 nm; Geometry.Height: 5.5mm; Manufacturer_Name: Wurth Elektronik; Manufacturer_Part_Number: 151031YS06000; Mouser Part Number: 710-151031YS06000; Mouser Price/Stock: https://www.mouser.co.uk/ProductDetail/Wurth-Elektronik/151031YS06000?qs=LlUlMxKIyB3xSYYW%252BcuBiQ%3D%3D; Arrow Part Number: *; Arrow Price/Stock: *; Mouser Testing Part Number: *; Mouser Testing Price/Stock: *; Datasheet Link: https://katalog.we-online.de/led/datasheet/151031YS06000.pdf
D23 = LMV358AIDR: Микросхема сдвоенный ОУ; ComponentDescription: =ComponentTypе+', '+Comment+', '+Package; ComponentTypе: Микросхема сдвоенный ОУ; Package: 8-SOIC
D48 = CMP-14400-000025-1: DIODE ZENER 5.1V 300MW SOD323
J1 J4 J15 = 691101710002: WR-TBL Series 101 Horizontal Entry Modular, THT, pitch 5mm, 2p; Manufacturer: Wurth Elektronik; Modularity: Yes; Rated Current: 16A; Working Voltage: 250V; ComponentLink1Description: Website Link; ComponentLink1URL: https://www.we-online.com/redexpert/article/691101710002?ad; ComponentLink2Description: Datasheet Link; ComponentLink2URL: https://www.we-online.com/redexpert/spec/691101710002?ad; Manufacturer Part Number: 691101710002; Category: Terminal Blocks; Match Code: WR-TBL; Mount: Through Hole; Operating Temperature Max: 105°C; Operating Temperature Min: -40°C; Packaging: Box; Application: Pressure Clamp; Number of Pins: 2; Number of Rows: 1; Orientation: Horizontal; Pitch: 5mm
J2 = 691101710003: WR-TBL Series 101 Horizontal Entry Modular, Through Hole, pitch 5mm, 3p; Manufacturer: Wurth Elektronik; Pin Number: 3; Rated Current: 16A; Working Voltage: 250V; PCB/Cable/Panel: PCB; Modularity: Yes; ComponentLink1Description: Manufacturer Link; ComponentLink1URL: https://www.we-online.com/redexpert/article/691101710003?ad; ComponentLink2Description: Datasheet; ComponentLink2URL: https://www.we-online.com/redexpert/spec/691101710003?ad; Category: Terminal Blocks; Match Code: WR-TBL; Manufacturer Part Number: 691101710003; Mount: Through Hole; Operating Temperature Max: 105°C; Operating Temperature Min: -40°C; Packaging: Box; Pitch: 5mm; Orientation: Horizontal; Application: Pressure Clamp
P1 P12 = CMP-1024-00357-1: 0.025" SQ Post Header, Through-hole, Vertical, -55 to 125 degC, 2.54 mm Pitch, 4-Pin, Male, RoHS; Manufacturer: Samtec; Pitch: 2.54 mm; RoHS: True; ComponentLink3URL: http://www.samtec.com/documents/webfiles/cpdf/TSW-XXX-XX-XXX-X-XX-XXX-MKT.pdf; Mounting Technology: Through-hole; ComponentLink2URL: http://www.samtec.com/documents/webfiles/pdf/TSW_TH.PDF; ComponentLink1URL: http://www.samtec.com; ComponentLink3Description: Package Specification; PackageVersion: DM, 8/1988; ComponentLink2Description: Datasheet; PackageReference: TSW-104-08-X-S; PackageDescription: .025[0.64] SQ. Post Terminal Strip Assembly; PartNumber: TSW-104-08-G-S; ComponentLink1Description: Manufacturer URL; Temperature Range: -55 to 125 degC; DatasheetVersion: F-214; Orientation: Vertical
P2 P4 P8-P11 = 61900311121: WR-WTB THT Male Vertical Locking Header, pitch 2.54mm, 3p; Pin Number: 3; Contact Resistance: 20mOhm; Rated Current: 3A; Withstanding Voltage: 1000VAC; Working Voltage: 250VAC; ComponentLink1Description: Manufacturer; ComponentLink1URL: http://www.we-online.de; ComponentLink2Description: Datasheet; ComponentLink2URL: https://www.we-online.com/catalog/datasheet/61900311121.pdf; Pitch: 2.54mm; Published Date: January 2020; Publisher: Wurth Elektronik; Mounting Technology: THT; Packaging: Bag; Operating Temperature: -40 to +105degC; Part Number: 61900311121; Gender: Male; Type: Vertical
P3 = 61900511121: WR-WTB THT Male Vertical Locking Header, pitch 2.54mm, 5pins; Manufacturer: Wurth Elektronik; Contact Resistance: 20mΩ; Rated Current: 3A; Working Voltage: 250VAC; Withstanding Voltage: 1000VAC; ComponentLink1Description: Website Link; ComponentLink1URL: https://www.we-online.com/redexpert/article/61900511121?ad; ComponentLink2Description: Datasheet Link; ComponentLink2URL: https://www.we-online.com/redexpert/spec/61900511121?ad; Manufacturer Part Number: 61900511121; Category: Wire-to-Board Connectors; Match Code: WR-WTB; Mount: Through Hole; Operating Temperature Max: 105°C; Operating Temperature Min: -40°C; Packaging: Bag; Length: 12.7mm; Width: 5.8mm; Height: 11.5mm; Gender: Male; Number of Pins: 5; Number of Rows: 1; Orientation: Vertical; Pitch: 2.54mm
P5-P7 = 61900611121: WR-WTB THT Male Vertical Locking Header, pitch 2.54mm, 6p; Pin Number: 6; Contact Resistance: 20mOhm; Rated Current: 3A; Withstanding Voltage: 1000VAC; Working Voltage: 250VAC; ComponentLink1Description: Manufacturer; ComponentLink1URL: http://www.we-online.de; ComponentLink2Description: Datasheet; ComponentLink2URL: https://www.we-online.com/catalog/datasheet/61900611121.pdf; Pitch: 2.54mm; Published Date: January 2020; Publisher: Wurth Elektronik; Mounting Technology: THT; Packaging: Bag; Operating Temperature: -40 to +105degC; Part Number: 61900611121; Gender: Male; Type: Vertical
P14 = 61300511121: WR-PHD Pin Header, THT, Vertical, pitch 2.54mm, 1 Row, 5P; Manufacturer: Wurth Elektronik; Contact Resistance: 20mΩ; Rated Current: 3A; Working Voltage: 250V; Withstanding Voltage: 500V; ComponentLink1Description: Website Link; ComponentLink1URL: https://www.we-online.com/redexpert/article/61300511121?ad; ComponentLink2Description: Datasheet Link; ComponentLink2URL: https://www.we-online.com/redexpert/spec/61300511121?ad; Manufacturer Part Number: 61300511121; Category: Board-to-Board Connectors; Match Code: WR-PHD; Mount: Through Hole; Operating Temperature Max: 105°C; Operating Temperature Min: -40°C; Packaging: Bag; Gender: Pin Header; Number of Pins: 5; Number of Rows: 1; Orientation: Vertical; Pitch: 2.54mm
R1 R2 R10 R17-R19 R21 R31-R34 R45-R48 R58-R61 R83-R89 R93 R94 R97 R99-R102 = CRCW08050000Z0EA
  R17-R19 R21 R31-R34 R45-R48 R58-R61 R83 R84: 100k: *
  R85-R88 R93 R94 R97 R99-R102: 10k: *
R3-R5 R8 R9 R20 R22 R38 R39 R57 R62-R67 R91 R92 R95 R96 R113 R? = RC0805FR-07100KL
R6 R7 R11 R12 R23-R26 R35-R37 R40 R49-R52 = CMP-03412-028725-1: RES SMD 10 OHM 1% 1/8W 0805; Manufacturer: Yageo; Tolerance: 0.0001; Value: 10Ω; Temperature Coefficient: 50 ppm/°C; Voltage Rating: 150V; Power Rating: 0.125W; Package: RT0805; Lead Free: Yes; Manufacturer Part Number: RT0805FRE0710RL; Series: RT; Footprint Url: http://www.yageo.com/exep/pages/download/literatures/PYu-R_Mount_10.pdf; Temperature Range High: +155°C; Temperature Range Low: -55°C; Octopart: https://octopart.com/rt0805fre0710rl-yageo-39855890; Height: 0.6mm; Device Class L1: Passive Components; Mouser Description: High Precision-High Stability Chip Resistor Thin Film 0805 10Ohm 1% Paper T/R; ComponentLink2URL: http://www.yageo.com/documents/recent/PYu-RT_1-to-0.01_RoHS_L_9.pdf; Device Class L2: Resistors; Composition: Thin Film; Device Class L3: Chip SMD Resistors; Automotive: No; RoHS: TRUE; Ipc Land Pattern Name: RESC200125X50; Temperature: -55°C to +155°C; ComponentLink2Description: Datasheet; Resistance: 10Ω; Category: Res; Digikey Description: RES SMD 10 OHM 1% 1/8W 0805
R13-R16 R27-R30 R41-R44 R53-R56 R98 = CMP-2001-04908-2: RES Thick Film, 10kΩ, 1%, 0.125W, 100ppm/°C, 0805; Resistance: 10kR; Voltage Rating (DC): 150V; Power Rating: 125mW; Weight: 0.000194oz; Package Quantity: 5000; Military Standard: Not; Max Operating Temperature: 155°C; Temperature Coefficient: 100ppm/°C; Contact Plating: Tin; Width: 1.25mm; Height: 0.45mm; Radiation Hardening: No; Tolerance: 1%; Min Operating Temperature: -55°C; Voltage Rating: 150V; Length: 2mm; Depth: 1.25mm; Termination: SMD/SMT; Packaging: Tape and Reel; Case/Package: 0805; Case Code (Metric): 2012; Lead Free: Lead Free; Case Code (Imperial): 0805; Composition: Thick Film
RG1 = Reg_Fairchild_LM7805CT_eec: REG IC REG LINEAR 5V 1A TO220AB; Voltage Dropout (Max): 2V @ 1A (Typ); Voltage - Input (Max): 35V; helpURL: https://upverter.com/upn/revision/b27a7358b7dd93a3/; ComponentLink2Description: Datasheet; Temperature: -40°C to +125°C; Package: TO220; Supplier 2: Mouser; Price: 0.384521982769; Supplier 1: Digi-Key; ComponentLink1URL: https://upverter.com/upn/revision/b27a7358b7dd93a3/; Supplier Part Number 2: 512-LM7805CT; Supplier Part Number 1: LM7805CT-ND; Manufacturer: Fairchild; ComponentLink1Description: Upverter; ComponentLink2URL: https://www.fairchildsemi.com/datasheets/LM/LM7805.pdf; RoHS: TRUE; Mouser Part Number: 512-LM7805CT; Ipc Land Pattern Name: TO-220; Temperature Range High: +125°C; Digikey Description: REG IC REG LINEAR 5V 1A TO220AB; Digikey Part Number: LM7805CT-ND; Lead Free: yes; Temperature Range Low: -40°C; Voltage - Output: 5V; Current-Output: 1A
RP6-RP9 = 3296W-1-202LF
TP1-TP46 TP?#1-TP?#11 = TP_PCB?: Test_Point
U1 = CMP-0062-01639-4: 800mA Low-Dropout Linear Regulator, 4-pin SOT-223, Pb-Free; Manufacturer: Texas Instruments; High-Reliability: Y; PowerWise: N; PackageTopMarking: XYTT*N05A; CompType: LDO IC; ComponentLink1URL: http://www.ti.com/general/docs/lit/getliterature.tsp?genericPartNumber=LM1117-N&fileType=pdf; PartNumber: LM1117MPX-3.3/NOPB; ComponentLink1Description: Datasheet URL; PinCount: 4; Code_JEDEC: TO-261-AA; PackageDescription: Molded SOT-223, 6.50 x 3.56 x 1.6mm Body, 4 Lead, 2.3mm Pitch; PackageReference: DCY0004A; RoHS: Y; Code_IPC: SOT223-4
U2 U5-U11 = IR2104SPBF: No Description Available; Mfr_Name: Infineon; Copyright: Copyright (C) 2023 Ultra Librarian. All rights reserved.; Manufacturer_Part_Number: IR2104SPBF; RefDes: RefDes; Type: DEV
U3 U18 = B0505s-1W: DC DC Converter 5V 1W
U4 = STM32F303CCT6: No Description Available; Mfr_Name: STMicroelectronics; RefDes: RefDes; Type: Type
U12 = CMP-0534-00654-1: Hot Swappable, Dual I2C Isolator, 3 to 5.5 V, -40 to 105 degC, 8-Pin SOIC (R-8), RoHS, Tube; Data Rate: 1 Mbps; Supply Voltage Max: 5.5 V; Supply Voltage Min: 3 V; ComponentLink1Description: Manufacturer URL; Mounting Technology: Surface Mount; RoHS: TRUE; ComponentLink2URL: http://www.analog.com/media/en/technical-documentation/data-sheets/ADUM1250_1251.pdf; Temperature Min: -40 degC; Generic Part Number: ADUM1250; PackageDescription: 8-Pin Small Outline Package, Body 4.9 x 3.9 mm, Pitch 1.27 mm; Temperature Max: 105 degC; ComponentLink1URL: http://www.analog.com/; Packing: Tube; DatasheetVersion: Rev. H; Code_JEDEC: MS-012-AA; PartNumber: ADuM1250ARZ; ComponentLink2Description: Datasheet
U13 = CMP-0534-00565-1: Quad Channel Digital Isolator, 2.5 KV rms Insulation Rating, 10 Mbps Data Rate, 50 ns Delay, Industrial, 16-pin SOIC (RW-16), Tube; Manufacturer: Analog Devices; Max Data Rate: 10Mbps; ComponentLink2URL: http://www.analog.com/static/imported-files/data_sheets/ADuM1400_1401_1402.pdf; ComponentLink5Description: URL Link2; ComponentLink3URL: http://www.analog.com/static/imported-files/packages/PKG_PDF/SOIC_WIDE%20%28RW%29/RW_16.pdf; DatasheetVersion: Rev. H; ComponentLink2Description: Datasheet; ComponentLink3Description: Package Specification; PartNumber: ADUM1401BRWZ; ComponentLink5URL: Reference Circuit:http://www.analog.com/en/interface-isolation/digital-isolators/adum1401/products/product.html#product-recommendations; Max Operating Temp (degreesC): 125; PackageReference: RW-16; PackageVersion: 032707-B, 03/2007; ComponentLink1Description: Manufacturer URL; Code_JEDEC: MS-013-AA; PackageDescription: 16-Pin Standard Small Outline Package, Body 10.3 x 7.5 mm, Pitch 1.27 mm; Mounting Technology: Surface Mount; ComponentLink1URL: http://www.analog.com/en/index.html; ComponentLink4Description: URL Link1; ComponentLink4URL: Product URL:http://www.analog.com/en/interface-isolation/digital-isolators/adum1401/products/product.html
X1 = CMP-2000-05726-1: Low Profile Crystal, 16.0 MHz, +/- 30 ppm, -20 to 70 degC, 2-Pin SMD, RoHS, Tape and Reel; Brand: ABRACON; Case Length: 11.4mm; Frequency Stability: 50PPM; ESR: 80Ohms; Case Height: 4.2mm; Tolerance: 30PPM; Frequency: 8MHz; Case Width: 4.7mm; Load Capacitance: 18pF; Datasheet Version: 04/2011; Termination Style: SMD/SMT; Dimensions: 4.7mmWx11.4mmLx4.2mmH; Packaging: Reel; Manufacturer: ABRACON; Package URL: http://www.abracon.com/Support/PackageDrawing/Resonators/ABLS-2D.pdf; Mounting Technology: SurfaceMount; Package Reference: ABLS-14.7456MHZ-B2-T; Product Category: Crystals; Package Description: 2-Pin Surface Mount Device, Body 11.4 x 4.7 mm; Package / Case: HC-49/US; Mounting Style: SMD/SMT; Operating Temperature Range: -20Cto+70C; Series: ABLS; Factory Pack Quantity: 1000; Datasheet URL: http://www.abracon.com/Resonators/abls.pdf; Manufacturer URL: http://www.abracon.com/; RoHS: Details; Type: LowProfileMicroprocessorCrystal
Z1 Z2 = MM3Z5V1ST1G: Zener Diode; Manufacturer_Name: onsemi; Datasheet Link: http://www.onsemi.com/pub/Collateral/MM3Z2V4ST1-D.PDF; Height: 1.1mm; Manufacturer_Part_Number: MM3Z5V1ST1G; Mouser Part Number: 863-MM3Z5V1ST1G; Mouser Price/Stock: https://www.mouser.co.uk/ProductDetail/onsemi/MM3Z5V1ST1G?qs=HVbQlW5zcXXFXX%2FQxsNWFg%3D%3D; Arrow Part Number: MM3Z5V1ST1G; Arrow Price/Stock: https://www.arrow.com/en/products/mm3z5v1st1g/on-semiconductor?region=nac